# Altium project rfsoc-fr1-beamformer.PrjPcb (part 2 of 2)

## Sheet Buck_TPSM82913_5V5.SchDoc
size B; SheetNumber: 7; SheetTotal: 12
Used 3 times, as channels U_Power/Buck_TPSM82913_5V5_A, U_Power/Buck_TPSM82913_5V5_B, U_Power/Buck_TPSM82913_5V5_C. Parts and nets are listed once, with the designators drawn on the sheet.
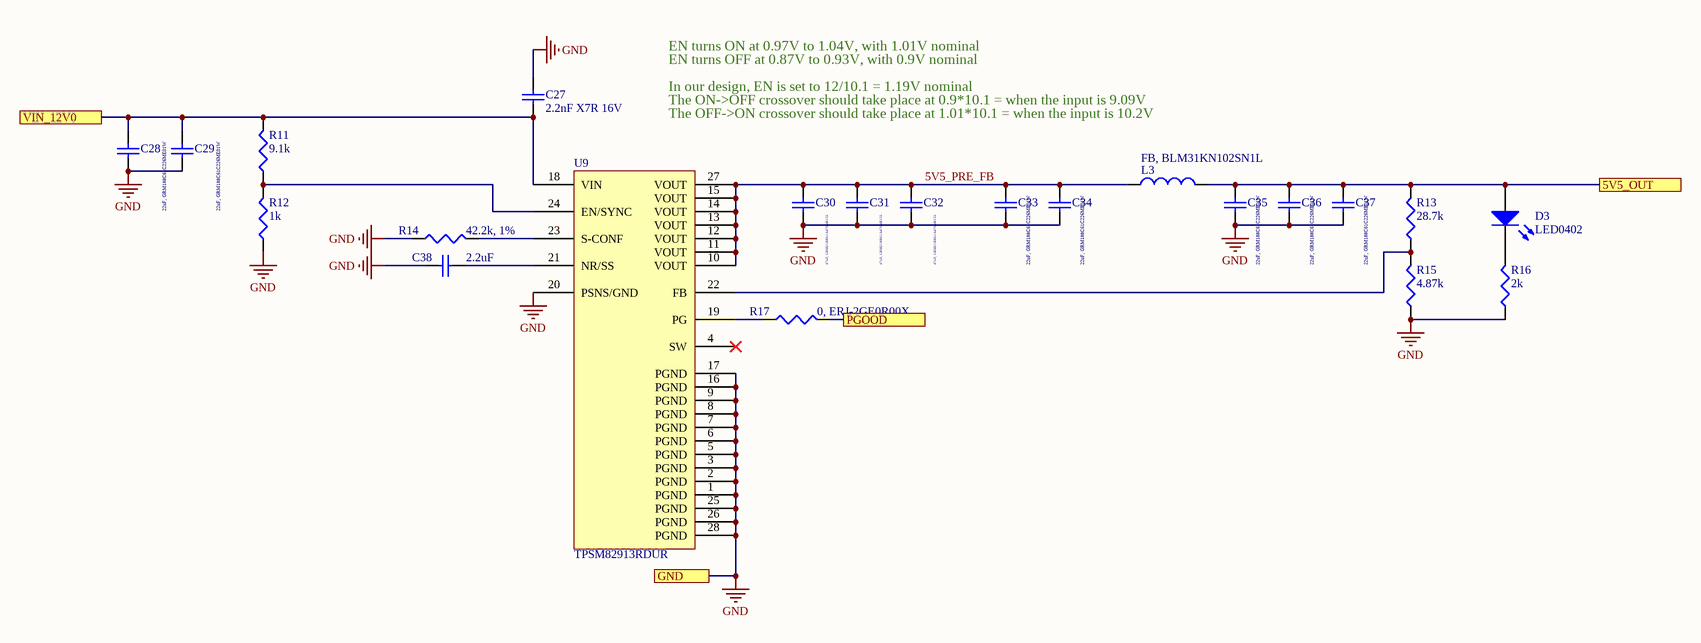
[diagram p9: Buck_TPSM82913_5V5.SchDoc]

### Parts
C27  2.2nF X7R 16V  [SMD-0402]
C28  22uF, GRM188C61C226ME01W  [SMD-0603]
C29  22uF, GRM188C61C226ME01W  [SMD-0603]
C30  47uF, GRM21BR61A476ME15L  [SMD-0805]
C31  47uF, GRM21BR61A476ME15L  [SMD-0805]
C32  47uF, GRM21BR61A476ME15L  [SMD-0805]
C33  22uF, GRM188C61C226ME01W  [SMD-0603]
C34  22uF, GRM188C61C226ME01W  [SMD-0603]
C35  22uF, GRM188C61C226ME01W  [SMD-0603]
C36  22uF, GRM188C61C226ME01W  [SMD-0603]
C37  22uF, GRM188C61C226ME01W  [SMD-0603]
C38  2.2uF  [SMD-0402]
D3  LED0402  [LED-0402]
L3  FB, BLM31KN102SN1L  [SMD-1206]
R11  9.1k  [SMD-0402]
R12  1k  [SMD-0402]
R13  28.7k  [SMD-0402]
R14  42.2k, 1%  [SMD-0402]
R15  4.87k  [SMD-0402]
R16  2k  [SMD-0402]
R17  0, ERJ-2GE0R00X  [SMD-0402]
U9  TPSM82913RDUR  [TPSM82913DRUR]

### Ports
5V5_OUT, GND, PGOOD, VIN_12V0

### Nets
GND: C27.2 C28.1 C29.1 C30.1 C31.1 C32.1 C33.1 C34.1 C35.1 C36.1 C37.1 C38.1 R12.1 R14.1 R15.1 R16.1 U9.1(PGND) U9.2(PGND) U9.3(PGND) U9.5(PGND) U9.6(PGND) U9.7(PGND) U9.8(PGND) U9.9(PGND) U9.16(PGND) U9.17(PGND) U9.20(PSNS/GND) U9.25(PGND) U9.26(PGND) U9.28(PGND) ; port GND
5V5_OUT: C35.2 C36.2 C37.2 D3.2(A) L3.2 R13.2 ; port 5V5_OUT
5V5_PRE_FB: C30.2 C31.2 C32.2 C33.2 C34.2 L3.1 U9.10(VOUT) U9.11(VOUT) U9.12(VOUT) U9.13(VOUT) U9.14(VOUT) U9.15(VOUT) U9.27(VOUT)
PGOOD: R17.2 ; port PGOOD
VIN_12V0: C27.1 C28.2 C29.2 R11.2 U9.18(VIN) ; port VIN_12V0
NetC38_2: C38.2 U9.21(NR/SS)
NetD3_1: D3.1(K) R16.2
NetR11_1: R11.1 R12.2 U9.24(EN/SYNC)
NetR13_1: R13.1 R15.2 U9.22(FB)
NetR14_2: R14.2 U9.23(S-CONF)
NetR17_1: R17.1 U9.19(PG)

Not connected (* = marked no-connect by the designer): U9 4(SW)*

### Channels
U_Power/Buck_TPSM82913_5V5_A: designators end in _1; ports 5V5_OUT=5V5_A GND=GND PGOOD=NetR17_1_2 VIN_12V0=+12
U_Power/Buck_TPSM82913_5V5_B: designators end in _2; ports 5V5_OUT=5V5_B GND=GND PGOOD=NetR17_2_2 VIN_12V0=+12
U_Power/Buck_TPSM82913_5V5_C: designators end in _3; ports 5V5_OUT=5V5_C GND=GND PGOOD=NetR17_3_2 VIN_12V0=+12

### Notes on the sheet
- EN turns OFF at 0.87V to 0.93V, with 0.9V nominal
- EN turns ON at 0.97V to 1.04V, with 1.01V nominal
- In our design, EN is set to 12/10.1 = 1.19V nominal
- The ON->OFF crossover should take place at 0.9*10.1 = when the input is 9.09V
- The OFF->ON crossover should take place at 1.01*10.1 = when the input is 10.2V

### Library data of the parts
C27 C38 = CAP0402: Ceramic Capacitor 0402
C28 C29 C33-C37 = CAP0603: Ceramic Capacitor 0603
C30-C32 = CAP0805: Ceramic Capacitor 0805 Imperial (2012 Metric)
D3 = LED0402: LED 0402
L3 = L1206: Inductor 1206
R11-R17 = RES0402: Resistor-0402
U9 = TPSM82913RDU

## Sheet Buck_TPSM843321_9V0.SchDoc
size A; SheetNumber: 8; SheetTotal: 17
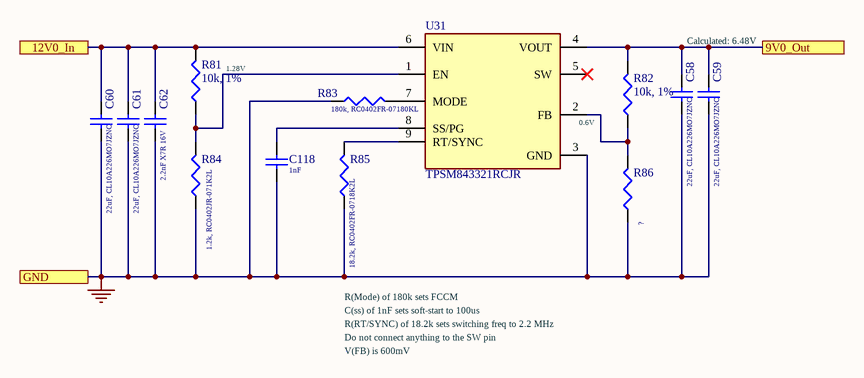
[diagram p10: Buck_TPSM843321_9V0.SchDoc]

### Parts
C58  22uF, CL10A226MO7JZNC  [SMD-0603]
C59  22uF, CL10A226MO7JZNC  [SMD-0603]
C60  22uF, CL10A226MO7JZNC  [SMD-0603]
C61  22uF, CL10A226MO7JZNC  [SMD-0603]
C62  2.2nF X7R 16V  [SMD-0402]
C118  1nF  [SMD-0402]
R81  10k, 1%  [SMD-0402]
R82  10k, 1%  [SMD-0402]
R83  180k, RC0402FR-07180KL  [SMD-0402]
R84  1.2k, RC0402JR-071K2L  [SMD-0402]
R85  18.2k, RC0402FR-0718K2L  [SMD-0402]
R86  ?  [SMD-0402]
U31  TPSM843321RCJR  [TPSM843321RCJR]

### Ports
9V0_Out, 12V0_In, GND

### Nets
9V0: C58.2 C59.2 R82.2 U31.4(VOUT) ; port 9V0_Out
+12: C60.2 C61.2 C62.2 R81.2 U31.6(VIN) ; port 12V0_In
GND: C58.1 C59.1 C60.1 C61.1 C62.1 C118.2 R83.1 R84.1 R85.1 R86.1 U31.3(GND) ; port GND
NetC118_1: C118.1 U31.8(SS/PG)
NetR81_1: R81.1 R84.2 U31.1(EN)
NetR82_1: R82.1 R86.2 U31.2(FB)
NetR83_2: R83.2 U31.7(MODE)
NetR85_2: R85.2 U31.9(RT/SYNC)

Not connected (* = marked no-connect by the designer): U31 5(SW)*

### Notes on the sheet
- Calculated: 6.48V
- (near R81) 1.28V
- (near U31) 0.6V
- R(RT/SYNC) of 18.2k sets switching freq to 2.2 MHz
- R(Mode) of 180k sets FCCM
- C(ss) of 1nF sets soft-start to 100us
- Do not connect anything to the SW pin
- V(FB) is 600mV

### Library data of the parts
C58-C61 = CAP0603: Ceramic Capacitor 0603
C62 C118 = CAP0402: Ceramic Capacitor 0402
R81-R86 = RES0402: Resistor-0402
U31 = TPSM843321RCJR: Non-Isolated PoL Module DC DC Converter 1 Output 5V 3A 3.8V - 18V Input; MF: Texas Instruments; SnapEDA_Link: https://www.snapeda.com/parts/TPSM843321RCJR/Texas+Instruments/view-part/?ref=snap; Package: None; Value: *; MP: TPSM843321RCJR; Check_prices: https://www.snapeda.com/parts/TPSM843321RCJR/Texas+Instruments/view-part/?ref=eda

## Sheet TX_PA_Stage2.SchDoc
size B; SheetNumber: 8; SheetTotal: 12
Used 8 times, as channels PA_A_00, PA_A_01, PA_A_02, PA_A_03, PA_A_04, PA_A_05, PA_A_06, PA_A_07. Parts and nets are listed once, with the designators drawn on the sheet.
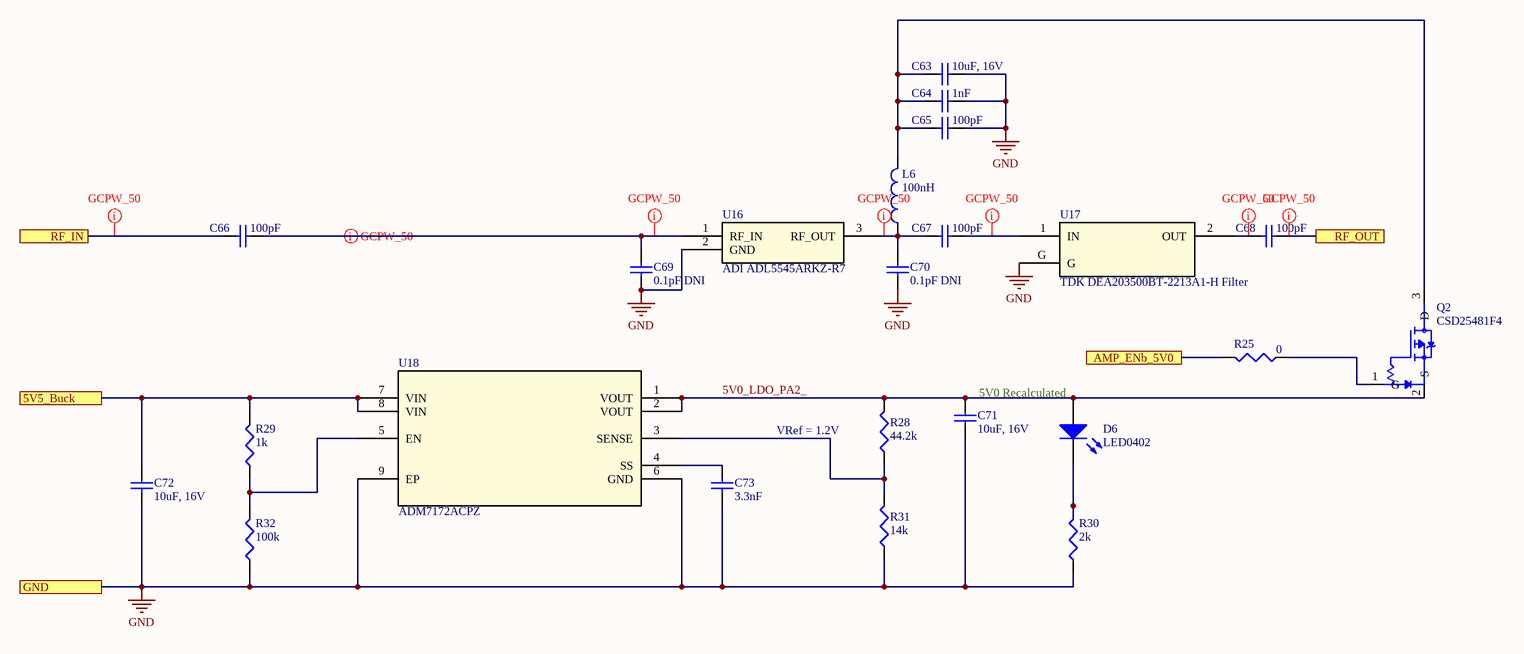
[diagram p11: TX_PA_Stage2.SchDoc]

### Parts
C63  10uF, 16V  [SMD-0603]
C64  1nF  [SMD-0402]
C65  100pF  [SMD-0402]
C66  100pF  [SMD-0402]
C67  100pF  [SMD-0402]
C68  100pF  [SMD-0402]
C69  0.1pF DNI  [SMD-0402]
C70  0.1pF DNI  [SMD-0402]
C71  10uF, 16V  [SMD-0603]
C72  10uF, 16V  [SMD-0603]
C73  3.3nF  [Johanson-0201]
D6  LED0402  [LED-0402]
L6  100nH  [SMD-0402]
Q2  CSD25481F4  [CSD25481F4]
R25  0  [SMD-0402]
R28  44.2k  [SMD-0402]
R29  1k  [SMD-0402]
R30  2k  [SMD-0402]
R31  14k  [SMD-0402]
R32  100k  [SMD-0402]
U16  ADI ADL5545ARKZ-R7  [Analog Devices ADL5545ARKZ]
U17  TDK DEA203500BT-2213A1-H Filter  [TDK DEA203500BT-2213A1-H Bandpass Filter]
U18  ADM7172ACPZ  [ADM7172_VIA_NOSILK]

### Ports
5V5_Buck, AMP_ENb_5V0, GND, RF_IN, RF_OUT

### Nets
GND: C63.1 C64.2 C65.2 C69.1 C70.1 C71.1 C72.1 C73.1 R30.1 R31.1 R32.1 U16.2(GND) U17.G U18.6(GND) U18.9(EP) ; port GND
5V0_LDO_PA2_: C71.2 D6.2(A) Q2.2(S) R28.2 U18.1(VOUT) U18.2(VOUT)
5V5_Buck: C72.2 R29.2 U18.7(VIN) U18.8(VIN) ; port 5V5_Buck
AMP_ENb_5V0: R25.2 ; port AMP_ENb_5V0
RF_IN: C66.1 ; port RF_IN
RF_OUT: C68.2 ; port RF_OUT
NetC63_2: C63.2 C64.1 C65.1 L6.2 Q2.3(D)
NetC66_2: C66.2 C69.2 U16.1(RF_IN)
NetC67_1: C67.1 C70.2 L6.1 U16.3(RF_OUT)
NetC67_2: C67.2 U17.1(IN)
NetC68_1: C68.1 U17.2(OUT)
NetC73_2: C73.2 U18.4(SS)
NetD6_1: D6.1(K) R30.2
NetQ2_1: Q2.1(G) R25.1
NetR28_1: R28.1 R31.2 U18.3(SENSE)
NetR29_1: R29.1 R32.2 U18.5(EN)

### Channels
PA_A_00: designators end in _1; ports 5V5_Buck=5V5_A AMP_ENb_5V0=TX_REF_ENb GND=GND RF_IN=NetC5_1_2 RF_OUT=NetC68_1_2
PA_A_01: designators end in _2; ports 5V5_Buck=5V5_A AMP_ENb_5V0=TX_MAIN_ENb GND=GND RF_IN=NetC5_2_2 RF_OUT=NetC21_16_2
PA_A_02: designators end in _3; ports 5V5_Buck=5V5_A AMP_ENb_5V0=TX_MAIN_ENb GND=GND RF_IN=NetC5_3_2 RF_OUT=NetC21_17_2
PA_A_03: designators end in _4; ports 5V5_Buck=5V5_A AMP_ENb_5V0=TX_MAIN_ENb GND=GND RF_IN=NetC5_4_2 RF_OUT=NetC21_18_2
PA_A_04: designators end in _5; ports 5V5_Buck=5V5_A AMP_ENb_5V0=TX_MAIN_ENb GND=GND RF_IN=NetC5_5_2 RF_OUT=NetC21_19_2
PA_A_05: designators end in _6; ports 5V5_Buck=5V5_A AMP_ENb_5V0=TX_MAIN_ENb GND=GND RF_IN=NetC5_6_2 RF_OUT=NetC21_20_2
PA_A_06: designators end in _7; ports 5V5_Buck=5V5_A AMP_ENb_5V0=TX_MAIN_ENb GND=GND RF_IN=NetC5_7_2 RF_OUT=NetC21_21_2
PA_A_07: designators end in _8; ports 5V5_Buck=5V5_A AMP_ENb_5V0=TX_MAIN_ENb GND=GND RF_IN=NetC5_8_2 RF_OUT=NetC21_22_2

### Layout directives
net class GCPW_50: NetC5_1_2, NetC66_1_2, NetC67_1_1, NetC67_1_2, NetC68_1_1, NetC68_1_2

### Notes on the sheet
- 5V0 Recalculated
- (near R28) VRef = 1.2V

### Library data of the parts
C63 C71 C72 = CAP0603: Ceramic Capacitor 0603
C64-C70 = CAP0402: Ceramic Capacitor 0402
C73 = CAP0201: Capacitor 0201 Imperial
D6 = LED0402: LED 0402
L6 = L0402: Inductor 0402
Q2 = CSD25481F4: -20V, P ch NexFET MOSFET, single LGA 0.6x1.0, 105mOhm 3-PICOSTAR -55 to 150; MF: Texas Instruments; MP: CSD25481F4; Purchase-URL: https://pricing.snapeda.com/search/part/CSD25481F4/?ref=eda; Price: None; SnapEDA_Link: https://www.snapeda.com/parts/CSD25481F4/Texas%20Instruments/view-part/808987/?ref=snap; Check_prices: https://www.snapeda.com/parts/CSD25481F4/Texas%20Instruments/view-part/808987/?ref=eda; Package: PICOSTAR-3 Texas Instruments; Availability: Good; Value: *
R25 R28-R32 = RES0402: Resistor-0402
U16 = ADI ADL5545ARKZ-R7: No Description Available; Mfr_Name: Analog Devices Inc; RefDes: RefDes; Type: Type
U17 = TDK DEA203500BT-2213A1-H Filter: 3.5 GHz Center Freq BPF; Mfr_Name: TDK; RefDes: RefDes; Type: Type
U18 = ADM7172ACPZ: 6.5V, 2A, Ultralow Noise, High PSRR, Fast Transient Response CMOS LDO; Value: Value; Type: Type; RefDes: RefDes

## Sheet Switch_SPDT.SchDoc
size A; SheetNumber: 10; SheetTotal: 17
Used 2 times, as channels U_Switch_SPDT, U_Switch_SPDT. Parts and nets are listed once, with the designators drawn on the sheet.
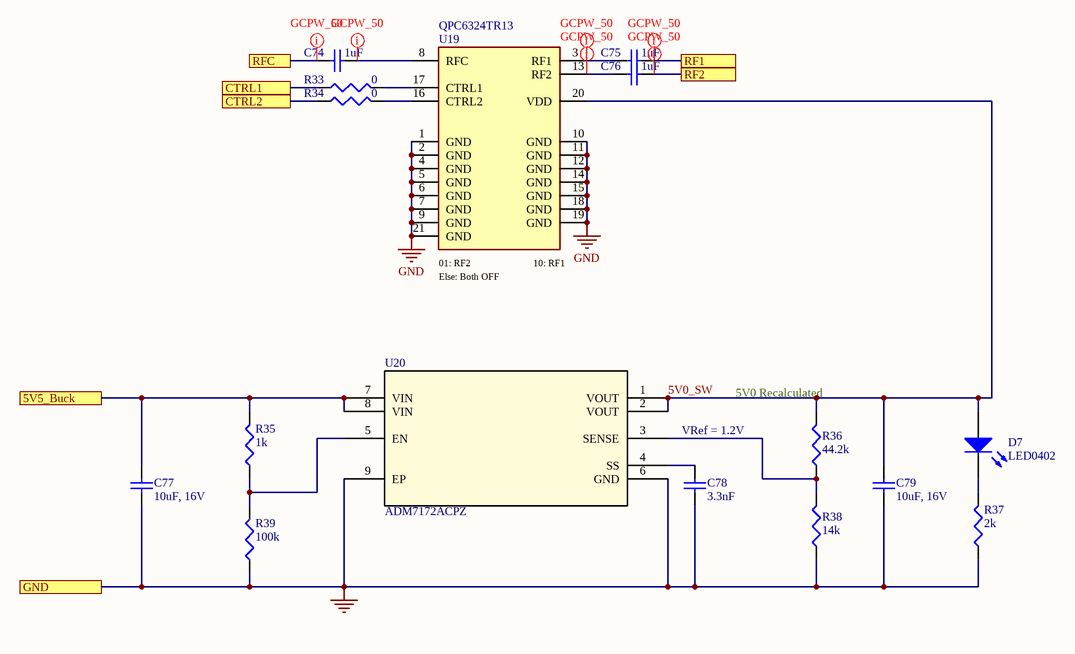
[diagram p12: Switch_SPDT.SchDoc]

### Parts
C74  1uF  [SMD-0402]
C75  1uF  [SMD-0402]
C76  1uF  [SMD-0402]
C77  10uF, 16V  [SMD-0603]
C78  3.3nF  [Johanson-0201]
C79  10uF, 16V  [SMD-0603]
D7  LED0402  [LED-0402]
R33  0  [SMD-0402]
R34  0  [SMD-0402]
R35  1k  [SMD-0402]
R36  44.2k  [SMD-0402]
R37  2k  [SMD-0402]
R38  14k  [SMD-0402]
R39  100k  [SMD-0402]
U19  QPC6324TR13  [Qorvo QFN50P400X400X90-21N-D]
U20  ADM7172ACPZ  [ADM7172_VIA_NOSILK]

### Ports
5V5_Buck, CTRL1, CTRL2, GND, RF1, RF2, RFC

### Nets
GND: C77.1 C78.1 C79.1 R37.1 R38.1 R39.1 U19.1(GND) U19.2(GND) U19.4(GND) U19.5(GND) U19.6(GND) U19.7(GND) U19.9(GND) U19.10(GND) U19.11(GND) U19.12(GND) U19.14(GND) U19.15(GND) U19.18(GND) U19.19(GND) U19.21(GND) U20.6(GND) U20.9(EP) ; port GND
5V0_SW: C79.2 D7.2(A) R36.2 U19.20(VDD) U20.1(VOUT) U20.2(VOUT)
5V5_Buck: C77.2 R35.2 U20.7(VIN) U20.8(VIN) ; port 5V5_Buck
CTRL1: R33.1 ; port CTRL1
CTRL2: R34.1 ; port CTRL2
RF1: C75.2 ; port RF1
RF2: C76.2 ; port RF2
RFC: C74.1 ; port RFC
NetC74_2: C74.2 U19.8(RFC)
NetC75_1: C75.1 U19.3(RF1)
NetC76_1: C76.1 U19.13(RF2)
NetC78_2: C78.2 U20.4(SS)
NetD7_1: D7.1(K) R37.2
NetR33_2: R33.2 U19.17(CTRL1)
NetR34_2: R34.2 U19.16(CTRL2)
NetR35_1: R35.1 R39.2 U20.5(EN)
NetR36_1: R36.1 R38.2 U20.3(SENSE)

### Channels
U_Switch_SPDT: designators end in _1; ports 5V5_Buck=5V5_A CTRL1=CTRL1 CTRL2=CTRL2 GND=GND RF1=NetC75_1_2 RF2=NetC76_1_2 RFC=NetC68_1_2
U_Switch_SPDT: designators end in _2; ports 5V5_Buck=5V5_C CTRL1=CTRL1 CTRL2=CTRL2 GND=GND RF1=NetC75_2_2 RF2=NetC76_2_2 RFC=NetC21_8_2

### Layout directives
net class GCPW_50: NetC68_1_2, NetC74_1_2, NetC75_1_1, NetC75_1_2, NetC76_1_1, NetC76_1_2

### Notes on the sheet
- (near R36) 5V0 Recalculated
- VRef = 1.2V
- (in symbol Qorvo QPC6324TR13) 01: RF2; 10: RF1; Else: Both OFF

### Library data of the parts
C74-C76 = CAP0402: Ceramic Capacitor 0402
C77 C79 = CAP0603: Ceramic Capacitor 0603
C78 = CAP0201: Capacitor 0201 Imperial
D7 = LED0402: LED 0402
R33-R39 = RES0402: Resistor-0402
U19 = Qorvo QPC6324TR13: 5 MHz to 6000 MHz Operation  Non-Reflective (RFX ports)  Terminated All-Off State mode  No Blocking Caps needed unless voltage is on RF Line  High Isolation: RFC-RFX: 63 dB at 2 GHz  RFX-RFX: 63 dB at 2 GHz  +1.8 V Logic Compatible; Manufacturer_Name: Qorvo; Geometry.Height: 0.9mm; Manufacturer_Part_Number: QPC6324TR13; Mouser Part Number: 772-QPC6324TR13; Mouser Price/Stock: https://www.mouser.co.uk/ProductDetail/Qorvo/QPC6324TR13?qs=W0yvOO0ixfHza5Li%252BN2uIg%3D%3D; Arrow Part Number: *; Arrow Price/Stock: *; Datasheet Link: https://www.qorvo.com/products/d/da006332
U20 = ADM7172ACPZ: as U18 on sheet TX_PA_Stage2; Value: Value; Type: Type; RefDes: RefDes

## Sheet Status_LEDs.SchDoc
size B; SheetNumber: 10; SheetTotal: 12
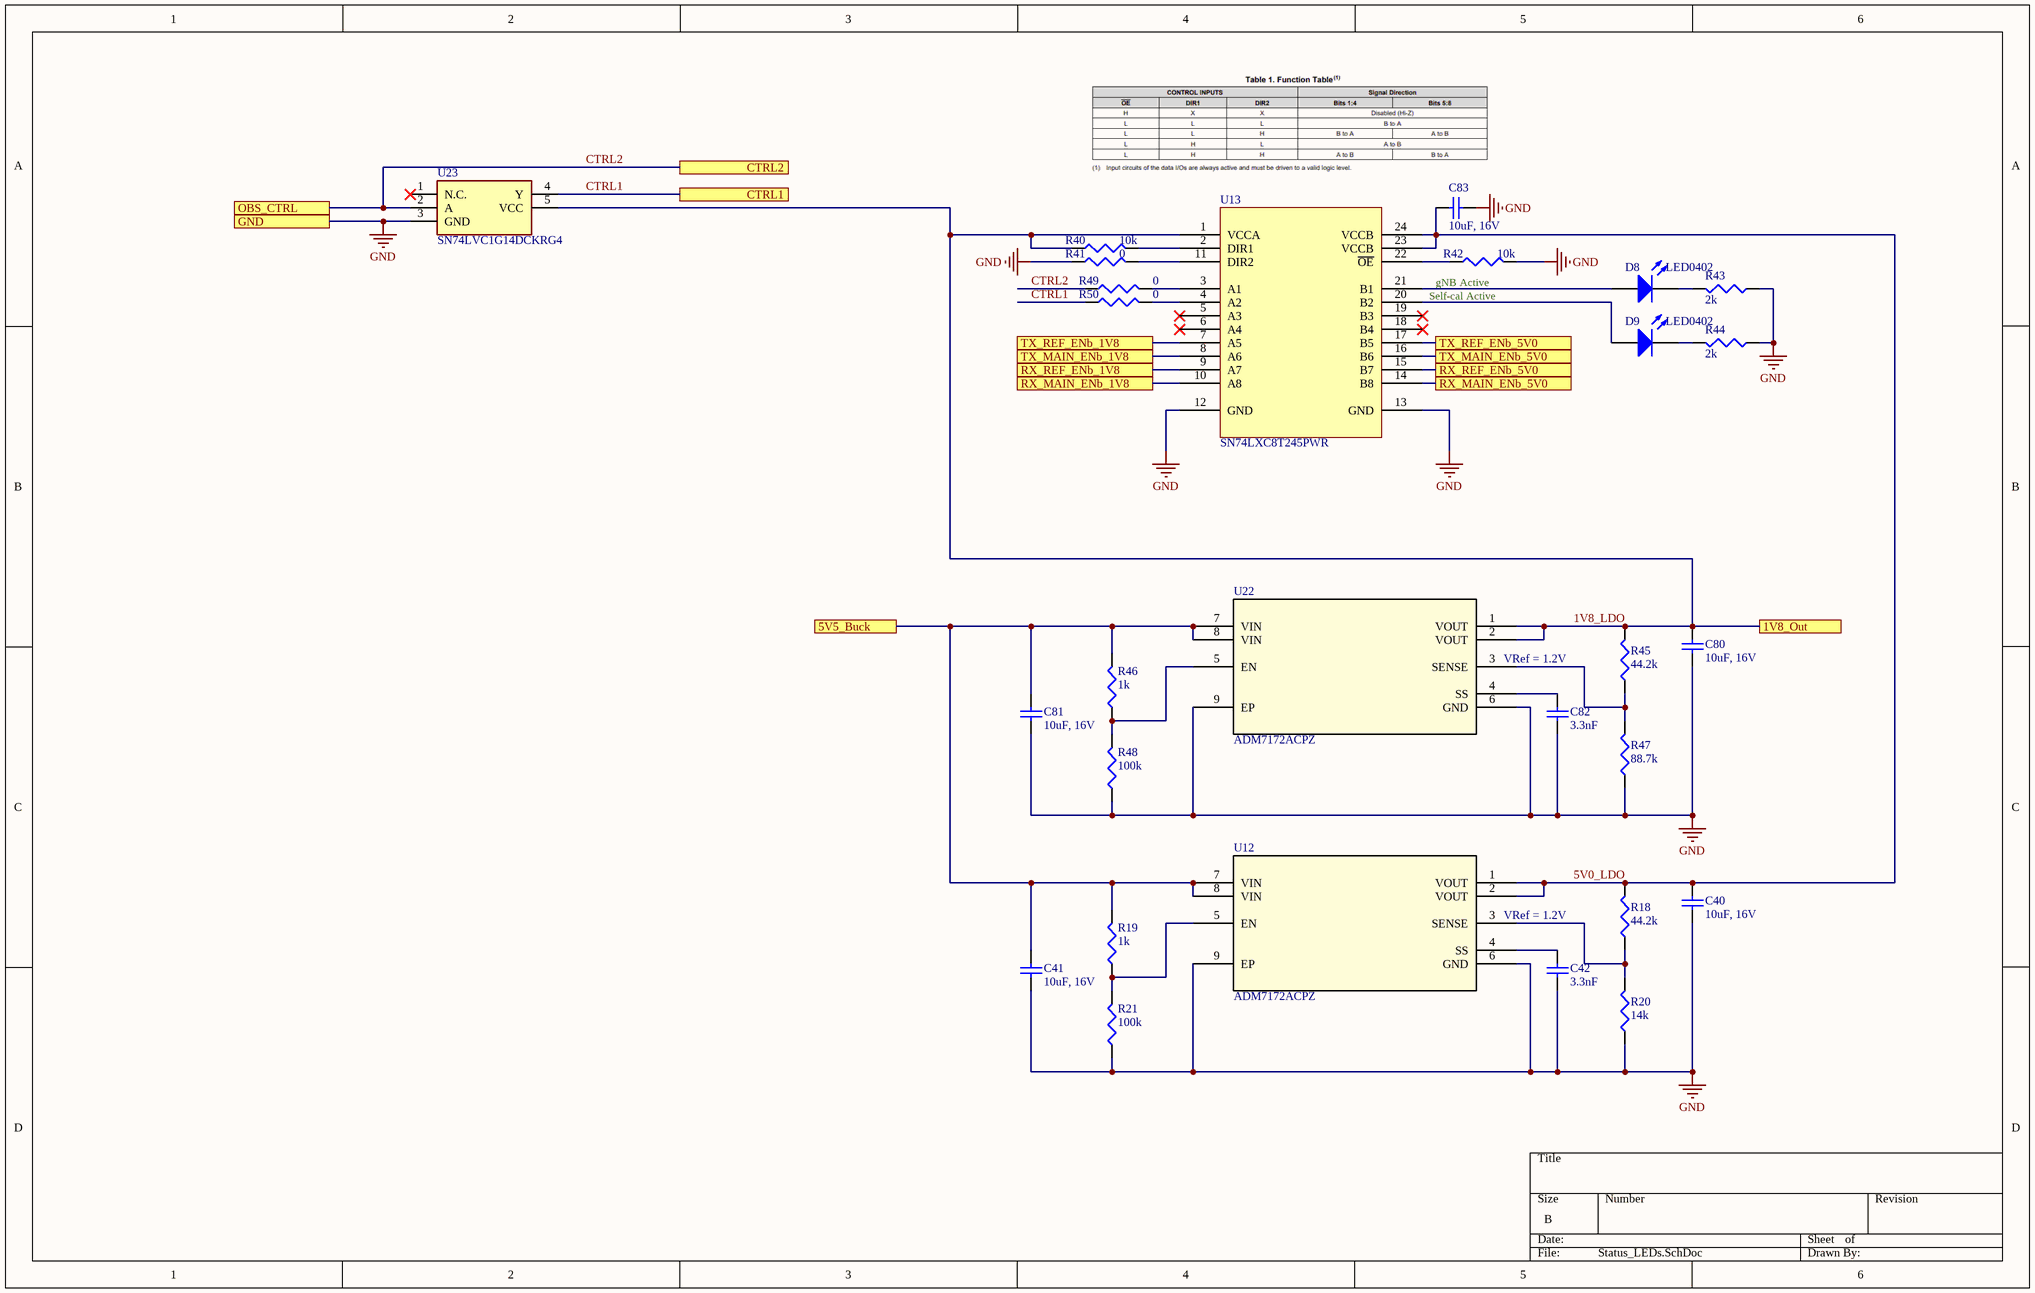
[diagram p13: Status_LEDs.SchDoc]

### Parts
C40  10uF, 16V  [SMD-0603]
C41  10uF, 16V  [SMD-0603]
C42  3.3nF  [Johanson-0201]
C80  10uF, 16V  [SMD-0603]
C81  10uF, 16V  [SMD-0603]
C82  3.3nF  [Johanson-0201]
C83  10uF, 16V  [SMD-0603]
D8  LED0402  [LED-0402]
D9  LED0402  [LED-0402]
R18  44.2k  [SMD-0402]
R19  1k  [SMD-0402]
R20  14k  [SMD-0402]
R21  100k  [SMD-0402]
R40  10k  [SMD-0402]
R41  0  [SMD-0402]
R42  10k  [SMD-0402]
R43  2k  [SMD-0402]
R44  2k  [SMD-0402]
R45  44.2k  [SMD-0402]
R46  1k  [SMD-0402]
R47  88.7k  [SMD-0402]
R48  100k  [SMD-0402]
R49  0  [SMD-0402]
R50  0  [SMD-0402]
U12  ADM7172ACPZ  [ADM7172_VIA_NOSILK]
U13  SN74LXC8T245PWR  [SN74AXC8T245PWR]
U22  ADM7172ACPZ  [ADM7172_VIA_NOSILK]
U23  SN74LVC1G14DCKRG4  [SN74LVC1G14DCKRG4]

### Ports
1V8_Out, 5V5_Buck, CTRL1, CTRL2, GND, OBS_CTRL, RX_MAIN_ENb_1V8, RX_MAIN_ENb_5V0, RX_REF_ENb_1V8, RX_REF_ENb_5V0, TX_MAIN_ENb_1V8, TX_MAIN_ENb_5V0, TX_REF_ENb_1V8, TX_REF_ENb_5V0

### Nets
5V5_B: C41.2 C81.2 R19.2 R46.2 U12.7(VIN) U12.8(VIN) U22.7(VIN) U22.8(VIN) ; port 5V5_Buck
GND: C40.1 C41.1 C42.1 C80.1 C81.1 C82.1 C83.1 R20.1 R21.1 R41.1 R42.2 R43.1 R44.1 R47.1 R48.1 U12.6(GND) U12.9(EP) U13.12(GND) U13.13(GND) U22.6(GND) U22.9(EP) U23.3(GND) ; port GND
1V8_LDO: C80.2 R40.1 R45.2 U13.1(VCCA) U22.1(VOUT) U22.2(VOUT) U23.5(VCC) ; port 1V8_Out
5V0_LDO: C40.2 C83.2 R18.2 U12.1(VOUT) U12.2(VOUT) U13.23(VCCB) U13.24(VCCB)
CTRL1: R50.1 U23.4(Y) ; port CTRL1
CTRL2: R49.1 U23.2(A) ; port OBS_CTRL, port CTRL2
RX_MAIN_ENb: U13.14(B8) ; port RX_MAIN_ENb_5V0
RX_MAIN_ENb_1V8: U13.10(A8) ; port RX_MAIN_ENb_1V8
RX_REF_ENb: U13.15(B7) ; port RX_REF_ENb_5V0
RX_REF_ENb_1V8: U13.9(A7) ; port RX_REF_ENb_1V8
TX_MAIN_ENb: U13.16(B6) ; port TX_MAIN_ENb_5V0
TX_MAIN_ENb_1V8: U13.8(A6) ; port TX_MAIN_ENb_1V8
TX_REF_ENb: U13.17(B5) ; port TX_REF_ENb_5V0
TX_REF_ENb_1V8: U13.7(A5) ; port TX_REF_ENb_1V8
NetC42_2: C42.2 U12.4(SS)
NetC82_2: C82.2 U22.4(SS)
NetD8_1: D8.1(K) R43.2
NetD8_2: D8.2(A) U13.21(B1)
NetD9_1: D9.1(K) R44.2
NetD9_2: D9.2(A) U13.20(B2)
NetR18_1: R18.1 R20.2 U12.3(SENSE)
NetR19_1: R19.1 R21.2 U12.5(EN)
NetR40_2: R40.2 U13.2(DIR1)
NetR41_2: R41.2 U13.11(DIR2)
NetR42_1: R42.1 U13.22(~{OE})
NetR45_1: R45.1 R47.2 U22.3(SENSE)
NetR46_1: R46.1 R48.2 U22.5(EN)
NetR49_2: R49.2 U13.3(A1)
NetR50_2: R50.2 U13.4(A2)

Not connected (* = marked no-connect by the designer): U13 5(A3)* 6(A4)* 18(B4)* 19(B3)*; U23 1(N.C.)*

### Notes on the sheet
- (near R42) gNB Active
- Self-cal Active
- VRef = 1.2V

### Library data of the parts
C40 C41 C80 C81 C83 = CAP0603: Ceramic Capacitor 0603
C42 C82 = CAP0201: Capacitor 0201 Imperial
D8 D9 = LED0402: LED 0402
R18-R21 R40-R50 = RES0402: Resistor-0402
U12 U22 = ADM7172ACPZ: as U18 on sheet TX_PA_Stage2; Value: Value; Type: Type; RefDes: RefDes
U13 = SN74AXC8T245PWR: SN74LXC8T245 8-Bit Dual-Supply Bus Transceiver With Configurable Voltage Translation / and Tri-State Outputs
U23 = SN74LVC1G14DCKRG4: Single Schmitt-Trigger Inverter; Manufacturer_Name: Texas Instruments; Geometry.Height: 1.1mm; Manufacturer_Part_Number: SN74LVC1G14DCKRG4; Mouser Part Number: 595-SN74LVC1G14DCKG4; Mouser Price/Stock: https://www.mouser.co.uk/ProductDetail/Texas-Instruments/SN74LVC1G14DCKRG4?qs=pajgIaoyDUh5K3ZGC7gUbg%3D%3D; Arrow Part Number: SN74LVC1G14DCKRG4; Arrow Price/Stock: https://www.arrow.com/en/products/sn74lvc1g14dckrg4/texas-instruments?utm_currency=USD&region=nac; Datasheet Link: http://www.ti.com/lit/gpn/SN74LVC1G14

## Sheet Trigger_Input.SchDoc
size A; SheetNumber: 11; SheetTotal: 12
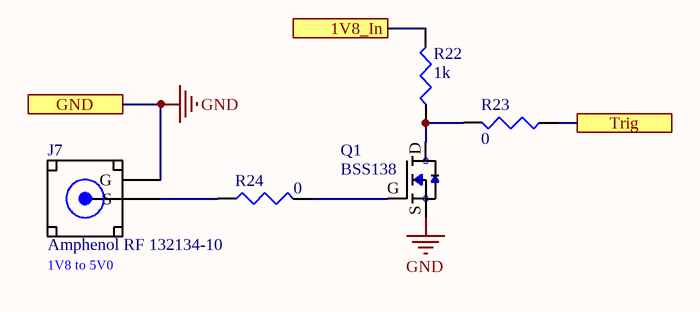
[diagram p14: Trigger_Input.SchDoc]

### Parts
J7  Amphenol RF 132134-10  [Amphenol RF 132134-10 HFSS 8.8 mil]
Q1  BSS138  [BSS138-SOT23]
R22  1k  [SMD-0603]
R23  0  [SMD-0603]
R24  0  [SMD-0603]

### Ports
1V8_In, GND, Trig

### Nets
GND: J7.G Q1.S ; port GND
1V8_LDO: R22.2 ; port 1V8_In
TRIG_IN_1V8: R23.1 ; port Trig
NetJ7_S: J7.S R24.1
NetQ1_D: Q1.D R22.1 R23.2
NetQ1_G: Q1.G R24.2

### Notes on the sheet
- (near J7) 1V8 to 5V0

### Library data of the parts
J7 = Amphenol RF 132134-10: RF / Coaxial Connector, SMA Coaxial, Straight Jack, Surface Mount Vertical, 50 ohm; MF: Samtec; MP: SMA-J-P-H-ST-EM1; Price: None; SnapEDA_Link: https://www.snapeda.com/parts/SMA-J-P-H-ST-EM1/Samtec%20Inc./view-part/?ref=snap; Package: None; Availability: Unavailable; Value: *
Q1 = BSS138: N-Channel Logic Level Enhancement Mode Field Effect Transistor; MF: MICROSS/On Semiconductor; MP: BSS138; Price: None; Availability: Unavailable; Package: TO-236-3 Micross; SnapEDA_Link: https://www.snapeda.com/parts/BSS138/MICROSS/On%20Semiconductor/view-part/?ref=snap; Value: *
R22-R24 = RES0603: Resistor-0603

## Sheet SE_Diff.SchDoc
size A; SheetNumber: 13; SheetTotal: 14
Used 8 times, as channels SE_Diff_RX_00, SE_Diff_RX_01, SE_Diff_RX_02, SE_Diff_RX_03, SE_Diff_RX_04, SE_Diff_RX_05, SE_Diff_RX_06, SE_Diff_RX_07. Parts and nets are listed once, with the designators drawn on the sheet.
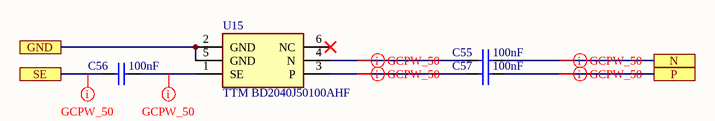
[diagram p15: SE_Diff.SchDoc]

### Parts
C55  100nF  [SMD-0402]
C56  100nF  [SMD-0402]
C57  100nF  [SMD-0402]
U15  TTM BD2040J50100AHF  [Anaren Balun BD2040J50100AHF]

### Ports
GND, N, P, SE

### Nets
GND: U15.2(GND) U15.5(GND) ; port GND
N: C55.1 ; port N
P: C57.1 ; port P
SE: C56.2 ; port SE
NetC55_2: C55.2 U15.4(N)
NetC56_1: C56.1 U15.1(SE)
NetC57_2: C57.2 U15.3(P)

Not connected (* = marked no-connect by the designer): U15 6(NC)*

### Channels
SE_Diff_RX_00: designators end in _1; ports GND=GND N=ADC_00_P P=ADC_00_N SE=NetC23_8_1
SE_Diff_RX_01: designators end in _2; ports GND=GND N=ADC_01_P P=ADC_01_N SE=NetC44_8_1
SE_Diff_RX_02: designators end in _3; ports GND=GND N=ADC_02_P P=ADC_02_N SE=NetC44_9_1
SE_Diff_RX_03: designators end in _4; ports GND=GND N=ADC_03_P P=ADC_03_N SE=NetC44_10_1
SE_Diff_RX_04: designators end in _5; ports GND=GND N=ADC_04_P P=ADC_04_N SE=NetC44_11_1
SE_Diff_RX_05: designators end in _6; ports GND=GND N=ADC_05_P P=ADC_05_N SE=NetC44_12_1
SE_Diff_RX_06: designators end in _7; ports GND=GND N=ADC_06_P P=ADC_06_N SE=NetC44_13_1
SE_Diff_RX_07: designators end in _8; ports GND=GND N=ADC_07_P P=ADC_07_N SE=NetC44_14_1

### Layout directives
net class GCPW_50: ADC_00_N, ADC_00_P, NetC23_8_1, NetC55_1_2, NetC56_1_1, NetC57_1_2

### Library data of the parts
C55-C57 = CAP0402: Ceramic Capacitor 0402
U15 = Anaren Balun - BD2040J50100AHF: Filter; Manufacturer_Name: ANAREN; Datasheet Link: https://cdn.anaren.com/product-documents/Xinger/BalunTransformers/BD2040J50100AHF/BD2040J50100AHF_DataSheet(Rev_C).pdf; Height: 0.78mm; Manufacturer_Part_Number: BD2040J50100AHF; Mouser Part Number: 620-BD2040J50100AH; Mouser Price/Stock: https://www.mouser.co.uk/ProductDetail/Anaren/BD2040J50100AHF?qs=BDRISUKNLIfZZVKLkyHFlw%3D%3D

## Sheet HMC625_VGA.SchDoc
size A; SheetNumber: 13; SheetTotal: 17
Used 14 times, as channels VGA_A_01, VGA_A_02, VGA_A_03, VGA_A_04, VGA_A_05, VGA_A_06, VGA_A_07, VGA_B_01, VGA_B_02, VGA_B_03, VGA_B_04, VGA_B_05, VGA_B_06, VGA_B_07. Parts and nets are listed once, with the designators drawn on the sheet.
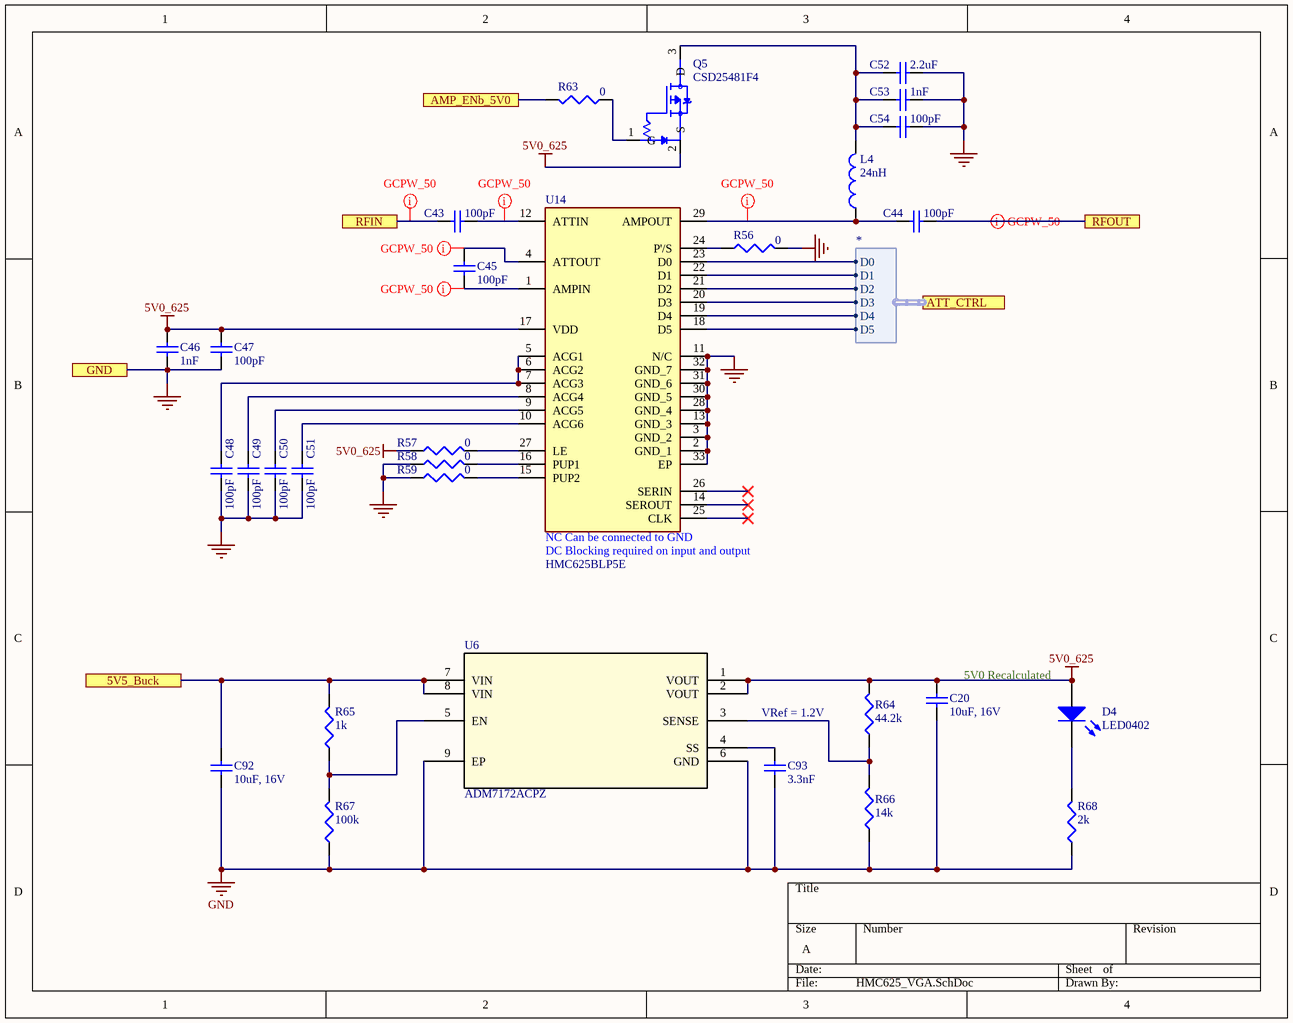
[diagram p16: HMC625_VGA.SchDoc]

### Parts
C20  10uF, 16V  [SMD-0603]
C43  100pF  [SMD-0402]
C44  100pF  [SMD-0402]
C45  100pF  [SMD-0402]
C46  1nF  [SMD-0402]
C47  100pF  [SMD-0402]
C48  100pF  [SMD-0402]
C49  100pF  [SMD-0402]
C50  100pF  [SMD-0402]
C51  100pF  [SMD-0402]
C52  2.2uF  [SMD-0603]
C53  1nF  [SMD-0402]
C54  100pF  [SMD-0402]
C92  10uF, 16V  [SMD-0603]
C93  3.3nF  [Johanson-0201]
D4  LED0402  [LED-0402]
L4  24nH  [L-0402-Coilcraft]
Q5  CSD25481F4  [CSD25481F4]
R56  0  [SMD-0402]
R57  0  [SMD-0402]
R58  0  [SMD-0402]
R59  0  [SMD-0402]
R63  0  [SMD-0402]
R64  44.2k  [SMD-0402]
R65  1k  [SMD-0402]
R66  14k  [SMD-0402]
R67  100k  [SMD-0402]
R68  2k  [SMD-0402]
U6  ADM7172ACPZ  [ADM7172_VIA_NOSILK]
U14  HMC625BLP5E  [Analog Devices HMC625BLP5E]

### Ports
5V5_Buck, AMP_ENb_5V0, ATT_CTRL (harness *), GND, RFIN, RFOUT

### Harnesses
*: D0, D1, D2, D3, D4, D5

### Nets
5V0_625: C20.2 C46.1 C47.1 D4.2(A) Q5.2(S) R57.1 R64.2 U6.1(VOUT) U6.2(VOUT) U14.17(VDD)
GND: C20.1 C46.2 C47.2 C48.2 C49.2 C50.2 C51.2 C52.2 C53.1 C54.1 C92.1 C93.1 R56.2 R58.1 R59.1 R66.1 R67.1 R68.1 U6.6(GND) U6.9(EP) U14.2(GND_1) U14.3(GND_2) U14.11(N/C) U14.13(GND_3) U14.28(GND_4) U14.30(GND_5) U14.31(GND_6) U14.32(GND_7) U14.33(EP) ; port GND
5V5_Buck: C92.2 R65.2 U6.7(VIN) U6.8(VIN) ; port 5V5_Buck
AMP_ENb_5V0: R63.2 ; port AMP_ENb_5V0
RFIN: C43.2 ; port RFIN
RFOUT: C44.1 ; port RFOUT
NetC43_1: C43.1 U14.12(ATTIN)
NetC44_2: C44.2 L4.1 U14.29(AMPOUT)
NetC45_1: C45.1 U14.4(ATTOUT)
NetC45_2: C45.2 U14.1(AMPIN)
NetC48_1: C48.1 U14.5(ACG1) U14.6(ACG2) U14.7(ACG3)
NetC49_1: C49.1 U14.8(ACG4)
NetC50_1: C50.1 U14.9(ACG5)
NetC51_1: C51.1 U14.10(ACG6)
NetC52_1: C52.1 C53.2 C54.2 L4.2 Q5.3(D)
NetC93_2: C93.2 U6.4(SS)
NetD4_1: D4.1(K) R68.2
NetQ5_1: Q5.1(G) R63.1
NetR56_1: R56.1 U14.24(P'/S)
NetR57_2: R57.2 U14.27(LE)
NetR58_2: R58.2 U14.16(PUP1)
NetR59_2: R59.2 U14.15(PUP2)
NetR64_1: R64.1 R66.2 U6.3(SENSE)
NetR65_1: R65.1 R67.2 U6.5(EN)
NetU14_18: U14.18(D5) ; port ATT_CTRL.D5
NetU14_19: U14.19(D4) ; port ATT_CTRL.D4
NetU14_20: U14.20(D3) ; port ATT_CTRL.D3
NetU14_21: U14.21(D2) ; port ATT_CTRL.D2
NetU14_22: U14.22(D1) ; port ATT_CTRL.D1
NetU14_23: U14.23(D0) ; port ATT_CTRL.D0

Not connected (* = marked no-connect by the designer): U14 14(SEROUT)* 25(CLK)* 26(SERIN)*

### Channels
VGA_A_01: designators end in _1; ports 5V5_Buck=5V5_B AMP_ENb_5V0=RX_MAIN_ENb GND=GND RFIN=NetC23_1_1 RFOUT=NetC21_9_2
VGA_A_02: designators end in _2; ports 5V5_Buck=5V5_B AMP_ENb_5V0=RX_MAIN_ENb GND=GND RFIN=NetC23_2_1 RFOUT=NetC21_10_2
VGA_A_03: designators end in _3; ports 5V5_Buck=5V5_B AMP_ENb_5V0=RX_MAIN_ENb GND=GND RFIN=NetC23_3_1 RFOUT=NetC21_11_2
VGA_A_04: designators end in _4; ports 5V5_Buck=5V5_B AMP_ENb_5V0=RX_MAIN_ENb GND=GND RFIN=NetC23_4_1 RFOUT=NetC21_12_2
VGA_A_05: designators end in _5; ports 5V5_Buck=5V5_B AMP_ENb_5V0=RX_MAIN_ENb GND=GND RFIN=NetC23_5_1 RFOUT=NetC21_13_2
VGA_A_06: designators end in _6; ports 5V5_Buck=5V5_B AMP_ENb_5V0=RX_MAIN_ENb GND=GND RFIN=NetC23_6_1 RFOUT=NetC21_14_2
VGA_A_07: designators end in _7; ports 5V5_Buck=5V5_B AMP_ENb_5V0=RX_MAIN_ENb GND=GND RFIN=NetC23_7_1 RFOUT=NetC21_15_2
VGA_B_01: designators end in _8; ports 5V5_Buck=5V5_C AMP_ENb_5V0=RX_MAIN_ENb GND=GND RFIN=NetC23_9_1 RFOUT=NetC44_8_1
VGA_B_02: designators end in _9; ports 5V5_Buck=5V5_C AMP_ENb_5V0=RX_MAIN_ENb GND=GND RFIN=NetC23_10_1 RFOUT=NetC44_9_1
VGA_B_03: designators end in _10; ports 5V5_Buck=5V5_C AMP_ENb_5V0=RX_MAIN_ENb GND=GND RFIN=NetC23_11_1 RFOUT=NetC44_10_1
VGA_B_04: designators end in _11; ports 5V5_Buck=5V5_C AMP_ENb_5V0=RX_MAIN_ENb GND=GND RFIN=NetC23_12_1 RFOUT=NetC44_11_1
VGA_B_05: designators end in _12; ports 5V5_Buck=5V5_C AMP_ENb_5V0=RX_MAIN_ENb GND=GND RFIN=NetC23_13_1 RFOUT=NetC44_12_1
VGA_B_06: designators end in _13; ports 5V5_Buck=5V5_C AMP_ENb_5V0=RX_MAIN_ENb GND=GND RFIN=NetC23_14_1 RFOUT=NetC44_13_1
VGA_B_07: designators end in _14; ports 5V5_Buck=5V5_C AMP_ENb_5V0=RX_MAIN_ENb GND=GND RFIN=NetC23_15_1 RFOUT=NetC44_14_1

### Layout directives
net class GCPW_50: NetC21_9_2, NetC23_1_1, NetC43_1_1, NetC44_1_2, NetC45_1_1, NetC45_1_2

### Notes on the sheet
- 5V0 Recalculated
- VRef = 1.2V
- (in symbol HMC625BLP5E) NC Can be connected to GND; DC Blocking required on input and output

### Library data of the parts
C20 C52 C92 = CAP0603: Ceramic Capacitor 0603
C43-C51 C53 C54 = CAP0402: Ceramic Capacitor 0402
C93 = CAP0201: Capacitor 0201 Imperial
D4 = LED0402: LED 0402
L4 = L0402_CoilCraft: Inductor 0402
Q5 = CSD25481F4: as Q2 on sheet TX_PA_Stage2; MP: CSD25481F4; Purchase-URL: https://pricing.snapeda.com/search/part/CSD25481F4/?ref=eda; Price: None; SnapEDA_Link: https://www.snapeda.com/parts/CSD25481F4/Texas%20Instruments/view-part/808987/?ref=snap; Check_prices: https://www.snapeda.com/parts/CSD25481F4/Texas%20Instruments/view-part/808987/?ref=eda; Package: PICOSTAR-3 Texas Instruments; Availability: Good; Value: *
R56-R59 R63-R68 = RES0402: Resistor-0402
U6 = ADM7172ACPZ: as U18 on sheet TX_PA_Stage2; Value: Value; Type: Type; RefDes: RefDes
U14 = HMC625BLP5E: Integrated Circuit; Manufacturer_Name: Analog Devices; Datasheet Link: https://www.analog.com/media/en/technical-documentation/data-sheets/HMC625B.pdf; Height: 1mm; Manufacturer_Part_Number: HMC625BLP5E; Mouser Part Number: 584-HMC625BLP5E; Mouser Price/Stock: https://www.mouser.co.uk/ProductDetail/Analog-Devices/HMC625BLP5E?qs=JeIcUl65ClAr51XD9R3nFw%3D%3D; Arrow Part Number: HMC625BLP5E; Arrow Price/Stock: https://www.arrow.com/en/products/hmc625blp5e/analog-devices

## Sheet PMA3-83MP+.SchDoc
size A; SheetNumber: 14; SheetTotal: 15
Used 7 times, as channels PMA_01, PMA_02, PMA_03, PMA_04, PMA_05, PMA_06, PMA_07. Parts and nets are listed once, with the designators drawn on the sheet.
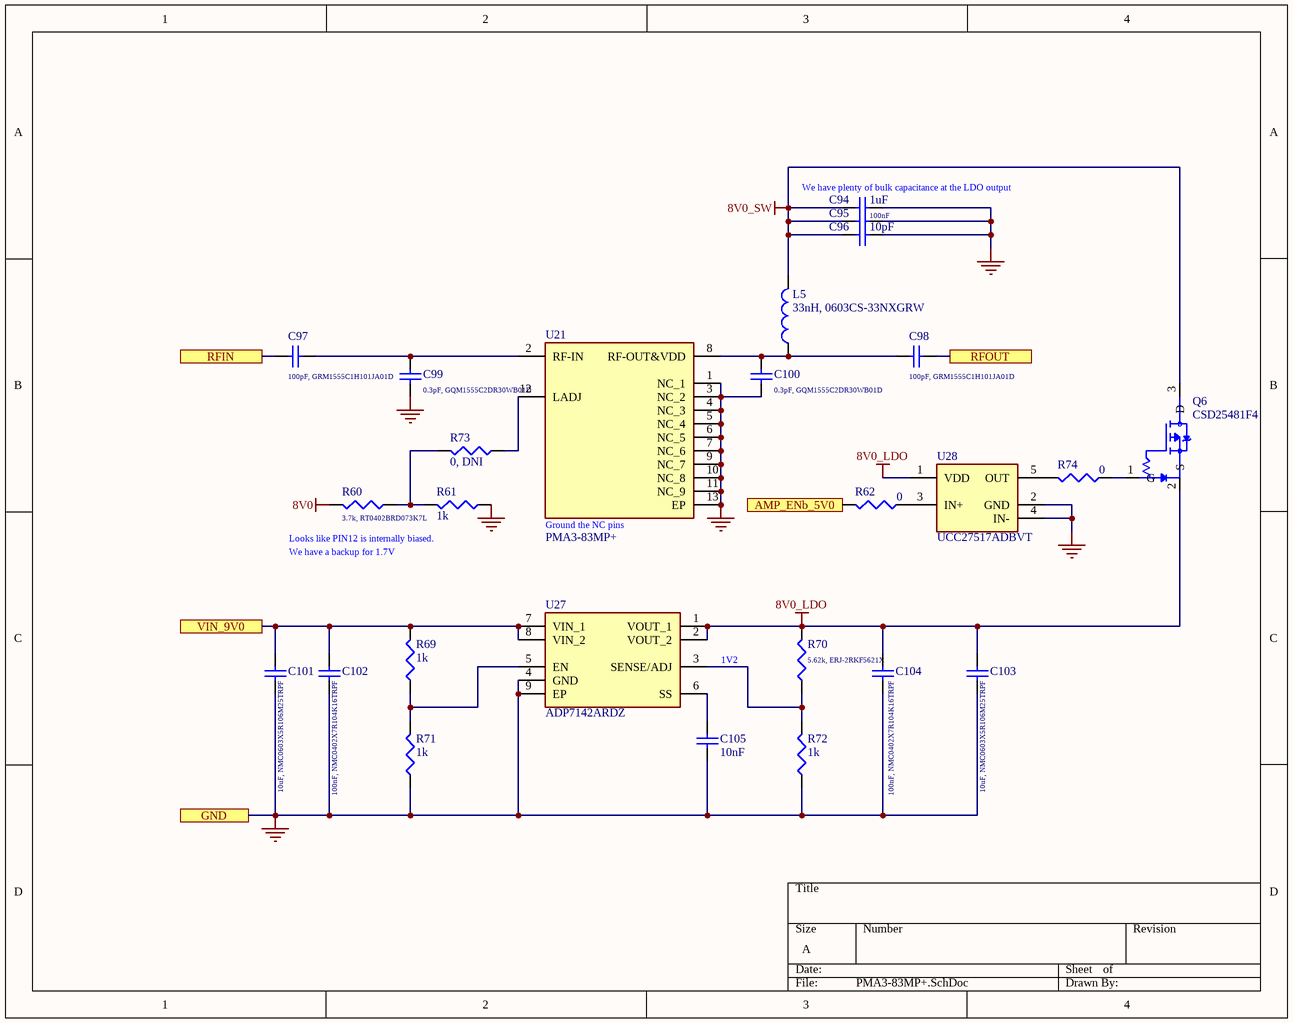
[diagram p17: PMA3-83MP+.SchDoc]

### Parts
C94  1uF  [SMD-0402]
C95  100nF  [SMD-0402]
C96  10pF  [SMD-0402]
C97  100pF, GRM1555C1H101JA01D  [SMD-0402]
C98  100pF, GRM1555C1H101JA01D  [SMD-0402]
C99  0.3pF, GQM1555C2DR30WB01D  [SMD-0402]
C100  0.3pF, GQM1555C2DR30WB01D  [SMD-0402]
C101  10uF, NMC0603X5R106M25TRPF  [SMD-0603]
C102  100nF, NMC0402X7R104K16TRPF  [SMD-0402]
C103  10uF, NMC0603X5R106M25TRPF  [SMD-0603]
C104  100nF, NMC0402X7R104K16TRPF  [SMD-0402]
C105  10nF  [SMD-0402]
L5  33nH, 0603CS-33NXGRW  [SMD-0603]
Q6  CSD25481F4  [CSD25481F4]
R60  3.7k, RT0402BRD073K7L  [SMD-0402]
R61  1k  [SMD-0402]
R62  0  [SMD-0402]
R69  1k  [SMD-0402]
R70  5.62k, ERJ-2RKF5621X  [SMD-0402]
R71  1k  [SMD-0402]
R72  1k  [SMD-0402]
R73  0, DNI  [SMD-0402]
R74  0  [SMD-0402]
U21  PMA3-83MP+  [MiniCircuits PMA3-83MP+]
U27  ADP7142ARDZ  [ADP7142ARDZ]
U28  UCC27517ADBVT  [TI UCC27517ADBVT]

### Ports
AMP_ENb_5V0, GND, RFIN, RFOUT, VIN_9V0

### Nets
8V0: R60.2
8V0_LDO: C103.2 C104.2 Q6.2(S) R70.2 U27.1(VOUT_1) U27.2(VOUT_2) U28.1(VDD)
8V0_SW: C94.1 C95.1 C96.1 L5.2 Q6.3(D)
GND: C94.2 C95.2 C96.2 C99.1 C100.2 C101.1 C102.1 C103.1 C104.1 C105.1 R61.1 R71.1 R72.1 U21.1(NC_1) U21.3(NC_2) U21.4(NC_3) U21.5(NC_4) U21.6(NC_5) U21.7(NC_6) U21.9(NC_7) U21.10(NC_8) U21.11(NC_9) U21.13(EP) U27.4(GND) U27.9(EP) U28.2(GND) U28.4(IN-) ; port GND
AMP_ENb_5V0: R62.2 ; port AMP_ENb_5V0
RFIN: C97.2 ; port RFIN
RFOUT: C98.2 ; port RFOUT
VIN_9V0: C101.2 C102.2 R69.2 U27.7(VIN_1) U27.8(VIN_2) ; port VIN_9V0
NetC97_1: C97.1 C99.2 U21.2(RF-IN)
NetC98_1: C98.1 C100.1 L5.1 U21.8(RF-OUT&VDD)
NetC105_2: C105.2 U27.6(SS)
NetQ6_1: Q6.1(G) R74.1
NetR60_1: R60.1 R61.2 R73.2
NetR62_1: R62.1 U28.3(IN+)
NetR69_1: R69.1 R71.2 U27.5(EN)
NetR70_1: R70.1 R72.2 U27.3(SENSE/ADJ)
NetR73_1: R73.1 U21.12(LADJ)
NetR74_2: R74.2 U28.5(OUT)

### Channels
PMA_01: designators end in _1; ports AMP_ENb_5V0=TX_MAIN_ENb GND=GND RFIN=NetC23_16_1 RFOUT=NetC98_1_2 VIN_9V0=9V0
PMA_02: designators end in _2; ports AMP_ENb_5V0=TX_MAIN_ENb GND=GND RFIN=NetC23_17_1 RFOUT=NetC98_2_2 VIN_9V0=9V0
PMA_03: designators end in _3; ports AMP_ENb_5V0=TX_MAIN_ENb GND=GND RFIN=NetC23_18_1 RFOUT=NetC98_3_2 VIN_9V0=9V0
PMA_04: designators end in _4; ports AMP_ENb_5V0=TX_MAIN_ENb GND=GND RFIN=NetC23_19_1 RFOUT=NetC98_4_2 VIN_9V0=9V0
PMA_05: designators end in _5; ports AMP_ENb_5V0=TX_MAIN_ENb GND=GND RFIN=NetC23_20_1 RFOUT=NetC98_5_2 VIN_9V0=9V0
PMA_06: designators end in _6; ports AMP_ENb_5V0=TX_MAIN_ENb GND=GND RFIN=NetC23_21_1 RFOUT=NetC98_6_2 VIN_9V0=9V0
PMA_07: designators end in _7; ports AMP_ENb_5V0=TX_MAIN_ENb GND=GND RFIN=NetC23_22_1 RFOUT=NetC98_7_2 VIN_9V0=9V0

### Notes on the sheet
- (near C94) We have plenty of bulk capacitance at the LDO output
- Looks like PIN12 is internally biased.
- We have a backup for 1.7V
- (near U27) 1V2
- (in symbol MiniCircuits PMA3-83MP+) Ground the NC pins

### Library data of the parts
C94-C100 C102 C104 C105 = CAP0402: Ceramic Capacitor 0402
C101 C103 = CAP0603: Ceramic Capacitor 0603
L5 = L0603: Inductor 0603
Q6 = CSD25481F4: as Q2 on sheet TX_PA_Stage2; MP: CSD25481F4; Purchase-URL: https://pricing.snapeda.com/search/part/CSD25481F4/?ref=eda; Price: None; SnapEDA_Link: https://www.snapeda.com/parts/CSD25481F4/Texas%20Instruments/view-part/808987/?ref=snap; Check_prices: https://www.snapeda.com/parts/CSD25481F4/Texas%20Instruments/view-part/808987/?ref=eda; Package: PICOSTAR-3 Texas Instruments; Availability: Good; Value: *
R60-R62 R69-R74 = RES0402: Resistor-0402
U21 = MiniCircuits PMA3-83MP+: RF Amplifier SMT Gain Block, 400 - 8000 MHz, 50 Ohm; Manufacturer_Name: Mini-Circuits; Geometry.Height: 0.89mm; Manufacturer_Part_Number: PMA3-83MP+; Mouser Part Number: 139-PMA3-83MP+; Mouser Price/Stock: https://www.mouser.co.uk/ProductDetail/Mini-Circuits/PMA3-83MP%2b?qs=t7xnP681wgVrgODXnnL%252BqQ%3D%3D; Arrow Part Number: *; Arrow Price/Stock: *; Datasheet Link: https://www.mouser.com/datasheet/2/1030/PMA3_83MP_2b-2941862.pdf
U27 = ADP7142ARDZ: 40 V, 200 mA, Low Noise, CMOS LDO Linear Regulator; Manufacturer_Name: Analog Devices; Geometry.Height: 1.75mm; Manufacturer_Part_Number: ADP7142ARDZ; Mouser Part Number: 584-ADP7142ARDZ; Mouser Price/Stock: https://www.mouser.co.uk/ProductDetail/Analog-Devices/ADP7142ARDZ?qs=hpwIUhX6lWzV4WLkPn0q6A%3D%3D; Arrow Part Number: ADP7142ARDZ; Arrow Price/Stock: https://www.arrow.com/en/products/adp7142ardz/analog-devices?region=europe; Datasheet Link: https://www.analog.com/ADP7142/datasheet
U28 = TI UCC27517ADBVT: 4A/4A Single Channel High-speed Low-side Gate Driver with 5V Negative Input Voltage Handling Ability; Manufacturer_Name: Texas Instruments; Geometry.Height: 1.45mm; Manufacturer_Part_Number: UCC27517ADBVT; Mouser Part Number: 595-UCC27517ADBVT; Mouser Price/Stock: https://www.mouser.co.uk/ProductDetail/Texas-Instruments/UCC27517ADBVT?qs=e5T%2FzGlhGOYaAK84OEzaaQ%3D%3D; Arrow Part Number: UCC27517ADBVT; Arrow Price/Stock: https://www.arrow.com/en/products/ucc27517adbvt_1/texas-instruments.html?utm_currency=USD&region=nac; Datasheet Link: http://www.ti.com/general/docs/lit/getliterature.tsp?genericPartNumber=UCC27517A&&fileType=pdf

## Sheet Power_Supply.SchDoc
size B; SheetNumber: 16; SheetTotal: 17
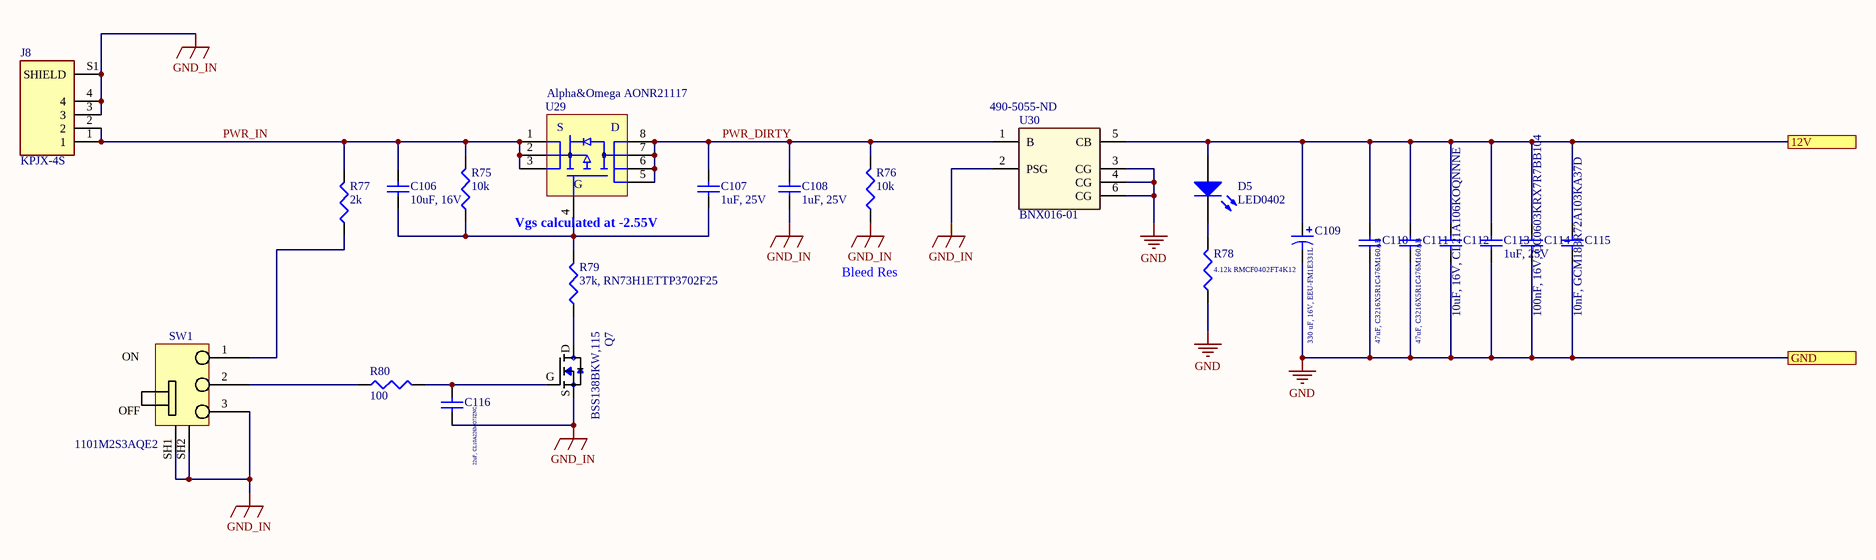
[diagram p18: Power_Supply.SchDoc]

### Parts
C106  10uF, 16V  [SMD-0603]
C107  1uF, 25V  [SMD-0603]
C108  1uF, 25V  [SMD-0603]
C109  330 uF, 16V, EEU-FM1E331L  [CAP-AXIAL-8.0-3.5]
C110  47uF, C3216X5R1C476M160AB  [SMD-1206]
C111  47uF, C3216X5R1C476M160AB  [SMD-1206]
C112  10uF, 16V, CL21A106KOQNNNE  [SMD-0805]
C113  1uF, 25V  [SMD-0603]
C114  100nF, 16V, CC0603KRX7R7BB104  [SMD-0603]
C115  10nF, GCM188R72A103KA37D  [SMD-0603]
C116  22uF, CL10A226MO7JZNC  [SMD-0603]
D5  LED0402  [LED-0402]
J8  KPJX-4S  [KYCON_KPJX-4S]
Q7  BSS138BKW,115  [BSS138BKW,115]
R75  10k  [SMD-0402]
R76  10k  [SMD-0402]
R77  2k  [SMD-0402]
R78  4.12k RMCF0402FT4K12  [SMD-0402]
R79  37k, RN73H1ETTP3702F25  [SMD-0402]
R80  100  [SMD-0402]
SW1  1101M2S3AQE2  [1101M2S3ABE2]
U29  Alpha&Omega AONR21117  [Alpha&Omega_AONR21321]
U30  BNX016-01  Supplier Part Number 1: 490-5055-ND  [FIL_BNX016-01]

### Ports
12V, GND

### Nets
+12: C109.1 C110.2 C111.2 C112.2 C113.2 C114.2 C115.2 D5.2(A) U30.5(CB) ; port 12V
GND: C109.2 C110.1 C111.1 C112.1 C113.1 C114.1 C115.1 R78.1 U30.3(CG) U30.4(CG) U30.6(CG) ; port GND
GND_IN: C108.1 C116.1 J8.3 J8.4 J8.S1(SHIELD) Q7.S R76.1 SW1.3 SW1.SH1 SW1.SH2 U30.2(PSG)
PWR_DIRTY: C107.2 C108.2 R76.2 U29.5 U29.6 U29.7 U29.8 U30.1(B)
PWR_IN: C106.2 J8.1 J8.2 R75.2 R77.2 U29.1 U29.2 U29.3
NetC106_1: C106.1 C107.1 R75.1 R79.2 U29.4
NetC116_2: C116.2 Q7.G R80.2
NetD5_1: D5.1(K) R78.2
NetQ7_D: Q7.D R79.1
NetR77_1: R77.1 SW1.1
NetR80_1: R80.1 SW1.2

### Notes on the sheet
- Vgs calculated at -2.55V
- Bleed Res
- (in symbol 11-1M2S3AQE2) ON; OFF
- (in symbol Alpha&Omega AONR21117) S; D; G

### Library data of the parts
C106 C114-C116 = CAP0603: Ceramic Capacitor 0603
C107 C108 C113 = CAP0603_HV: Ceramic Capacitor 0603, 25V
C109 = CAP_ELECTRO: CAP ALUM 330UF 20% 25V RADIAL EEU-FM1E331
C110 C111 = CAP1206: Ceramic Capacitor 1206 Imperial
C112 = CAP0805: as C30 on sheet Buck_TPSM82913_5V5
D5 = LED0402: LED 0402
J8 = KPJX-4S: 4 _Power_ Position Circular Connector Jack, Female Sockets Solder; MF: Kycon; Value: *; Package: DIP-20 Kycon; Price: None; MP: KPJX-4S; Availability: Unavailable; SnapEDA_Link: https://www.snapeda.com/parts/KPJX-4S/Kycon/view-part/555404/?ref=snap
Q7 = BSS138: as Q1 on sheet Trigger_Input; MP: BSS138; Price: None; Availability: Unavailable; Package: TO-236-3 Micross; SnapEDA_Link: https://www.snapeda.com/parts/BSS138/MICROSS/On%20Semiconductor/view-part/?ref=snap; Value: *
R75-R80 = RES0402: Resistor-0402
SW1 = 11-1M2S3AQE2: SPDT, RIGHT ANGLE, PC THRU-HOLE; pin to pad: SH1>4 SH2>5
U29 = Alpha&Omega AONR21117: P-Channel 20-V (D-S) MOSFET
U30 = BNX016-01: Filter: anti-interference; wideband; Mounting: THT; 15A; -40Ã·125Â°; MF: Murata Electronics; MP: BNX016-01; Digi-Key_Purchase_URL: https://www.digikey.com/product-detail/en/murata-electronics/BNX016-01/490-5055-ND/1825576?utm_source=snapeda&utm_medium=aggregator&utm_campaign=symbol; Package: Block-4 Murata; SnapEDA_Link: https://www.snapeda.com/parts/BNX016-01/Murata%20Electronics%20North%20America/view-part/?ref=snap; Digi-Key_Part_Number: 490-5055-ND; Value: *; Supplier 1: Digi-Key

## Sheet RX_LNA_Preamp.SchDoc
size A4; SheetNumber: 11; SheetTotal: 13
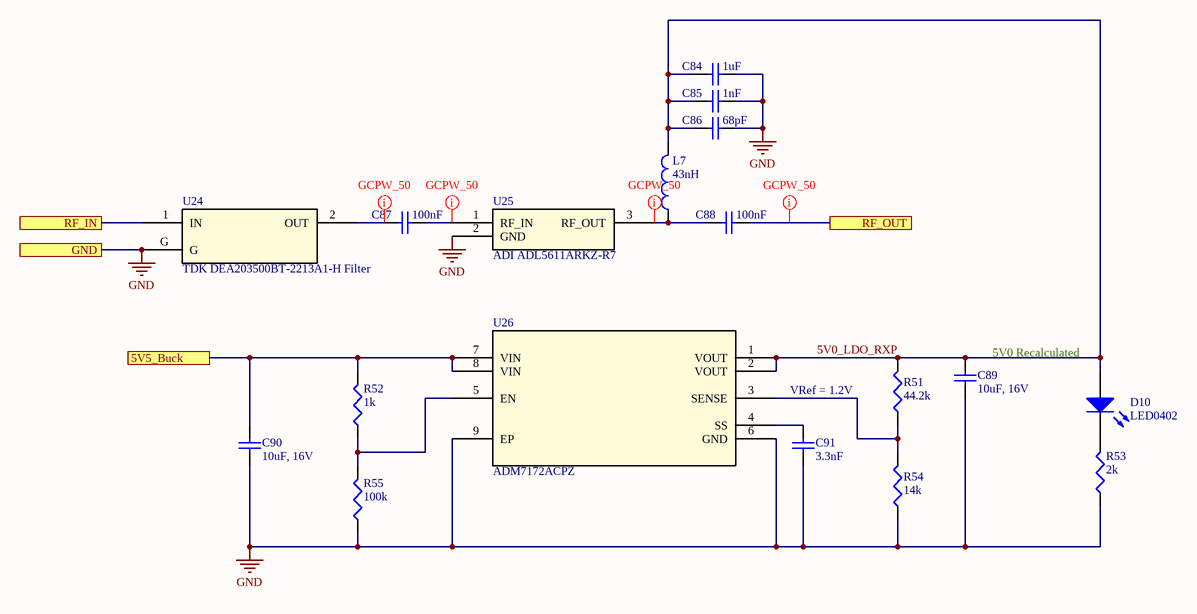
[diagram p19: RX_LNA_Preamp.SchDoc]

### Parts
C84  1uF  [SMD-0402]
C85  1nF  [SMD-0402]
C86  68pF  [SMD-0402]
C87  100nF  [SMD-0402]
C88  100nF  [SMD-0402]
C89  10uF, 16V  [SMD-0603]
C90  10uF, 16V  [SMD-0603]
C91  3.3nF  [Johanson-0201]
D10  LED0402  [LED-0402]
L7  43nH  [SMD-0603]
R51  44.2k  [SMD-0402]
R52  1k  [SMD-0402]
R53  2k  [SMD-0402]
R54  14k  [SMD-0402]
R55  100k  [SMD-0402]
U24  TDK DEA203500BT-2213A1-H Filter  [TDK DEA203500BT-2213A1-H Bandpass Filter]
U25  ADI ADL5611ARKZ-R7  [Analog Devices ADL5545ARKZ]
U26  ADM7172ACPZ  [ADM7172_VIA_NOSILK]

### Ports
5V5_Buck, GND, RF_IN, RF_OUT

### Nets
GND: C84.1 C85.1 C86.1 C89.1 C90.1 C91.1 R53.1 R54.1 R55.1 U24.G U25.2(GND) U26.6(GND) U26.9(EP) ; port GND
5V0_LDO_RXP: C84.2 C85.2 C86.2 C89.2 D10.1(A) L7.2 R51.2 U26.1(VOUT) U26.2(VOUT)
NetC87_1: C87.1 U25.1(RF_IN)
NetC87_2: C87.2 U24.2(OUT)
NetC88_1: C88.1 ; port RF_OUT
NetC88_2: C88.2 L7.1 U25.3(RF_OUT)
NetC90_2: C90.2 R52.2 U26.7(VIN) U26.8(VIN) ; port 5V5_Buck
NetC91_2: C91.2 U26.4(SS)
NetD10_2: D10.2(K) R53.2
NetR51_1: R51.1 R54.2 U26.3(SENSE)
NetR52_1: R52.1 R55.2 U26.5(EN)
NetU24_1: U24.1(IN) ; port RF_IN

### Layout directives
net class GCPW_50: NetC87_1, NetC87_2, NetC88_1, NetC88_2

### Notes on the sheet
- 5V0 Recalculated
- VRef = 1.2V

### Library data of the parts
C84-C88 = CAP0402: Ceramic Capacitor 0402
C89 C90 = CAP0603: Ceramic Capacitor 0603
C91 = CAP0201: Capacitor 0201 Imperial
D10 = LED0402: LED 0402
L7 = L0603: Inductor 0603
R51-R55 = RES0402: Resistor-0402
U24 = TDK DEA203500BT-2213A1-H Filter: 3.5 GHz Center Freq BPF; Mfr_Name: TDK; RefDes: RefDes; Type: Type
U25 = ADI ADL5611ARKZ-R7: IC AMP W-CDMA 30MHZ-6GHZ SOT89-3; Mfr_Name: Analog Devices Inc; RefDes: RefDes; Type: Type
U26 = ADM7172ACPZ: as U18 on sheet TX_PA_Stage2; Value: Value; Type: Type; RefDes: RefDes

## Nets that join several sheets
5V5_A: TX_PA_00 (C9_1.2 R2_1.2 U4_1.7 U4_1.8), TX_PA_01 (C9_2.2 R2_2.2 U4_2.7 U4_2.8), TX_PA_02 (C9_3.2 R2_3.2 U4_3.7 U4_3.8), TX_PA_03 (C9_4.2 R2_4.2 U4_4.7 U4_4.8), TX_PA_04 (C9_5.2 R2_5.2 U4_5.7 U4_5.8), TX_PA_05 (C9_6.2 R2_6.2 U4_6.7 U4_6.8), TX_PA_06 (C9_7.2 R2_7.2 U4_7.7 U4_7.8), TX_PA_07 (C9_8.2 R2_8.2 U4_8.7 U4_8.8), U_Power/Buck_TPSM82913_5V5_A (6 pins), PA_A_00 (C72_1.2 R29_1.2 U18_1.7 U18_1.8), PA_A_01 (C72_2.2 R29_2.2 U18_2.7 U18_2.8), PA_A_02 (C72_3.2 R29_3.2 U18_3.7 U18_3.8), PA_A_03 (C72_4.2 R29_4.2 U18_4.7 U18_4.8), PA_A_04 (C72_5.2 R29_5.2 U18_5.7 U18_5.8), PA_A_05 (C72_6.2 R29_6.2 U18_6.7 U18_6.8), PA_A_06 (C72_7.2 R29_7.2 U18_7.7 U18_7.8), PA_A_07 (C72_8.2 R29_8.2 U18_8.7 U18_8.8), U_Switch_SPDT (C77_1.2 R35_1.2 U20_1.7 U20_1.8), TX_Final_Amp_01 (C25_16.2 R7_16.2 U8_16.7 U8_16.8), TX_Final_Amp_02 (C25_17.2 R7_17.2 U8_17.7 U8_17.8), TX_Final_Amp_03 (C25_18.2 R7_18.2 U8_18.7 U8_18.8), TX_Final_Amp_04 (C25_19.2 R7_19.2 U8_19.7 U8_19.8), TX_Final_Amp_05 (C25_20.2 R7_20.2 U8_20.7 U8_20.8), TX_Final_Amp_06 (C25_21.2 R7_21.2 U8_21.7 U8_21.8), TX_Final_Amp_07 (C25_22.2 R7_22.2 U8_22.7 U8_22.8)
5V5_B: RX_LNA_A_01 (C25_1.2 R7_1.2 U8_1.7 U8_1.8), RX_LNA_A_02 (C25_2.2 R7_2.2 U8_2.7 U8_2.8), RX_LNA_A_03 (C25_3.2 R7_3.2 U8_3.7 U8_3.8), RX_LNA_A_04 (C25_4.2 R7_4.2 U8_4.7 U8_4.8), RX_LNA_A_05 (C25_5.2 R7_5.2 U8_5.7 U8_5.8), RX_LNA_A_06 (C25_6.2 R7_6.2 U8_6.7 U8_6.8), RX_LNA_A_07 (C25_7.2 R7_7.2 U8_7.7 U8_7.8), U_Power/Buck_TPSM82913_5V5_B (6 pins), Status_LEDs (8 pins), VGA_A_01 (C92_1.2 R65_1.2 U6_1.7 U6_1.8), VGA_A_02 (C92_2.2 R65_2.2 U6_2.7 U6_2.8), VGA_A_03 (C92_3.2 R65_3.2 U6_3.7 U6_3.8), VGA_A_04 (C92_4.2 R65_4.2 U6_4.7 U6_4.8), VGA_A_05 (C92_5.2 R65_5.2 U6_5.7 U6_5.8), VGA_A_06 (C92_6.2 R65_6.2 U6_6.7 U6_6.8), VGA_A_07 (C92_7.2 R65_7.2 U6_7.7 U6_7.8)
5V5_C: RX_LNA_A_00 (C25_8.2 R7_8.2 U8_8.7 U8_8.8), U_Power/Buck_TPSM82913_5V5_C (6 pins), U_Switch_SPDT (C77_2.2 R35_2.2 U20_2.7 U20_2.8), RX_LNA_B_01 (C25_9.2 R7_9.2 U8_9.7 U8_9.8), RX_LNA_B_02 (C25_10.2 R7_10.2 U8_10.7 U8_10.8), RX_LNA_B_03 (C25_11.2 R7_11.2 U8_11.7 U8_11.8), RX_LNA_B_04 (C25_12.2 R7_12.2 U8_12.7 U8_12.8), RX_LNA_B_05 (C25_13.2 R7_13.2 U8_13.7 U8_13.8), RX_LNA_B_06 (C25_14.2 R7_14.2 U8_14.7 U8_14.8), RX_LNA_B_07 (C25_15.2 R7_15.2 U8_15.7 U8_15.8), VGA_B_01 (C92_8.2 R65_8.2 U6_8.7 U6_8.8), VGA_B_02 (C92_9.2 R65_9.2 U6_9.7 U6_9.8), VGA_B_03 (C92_10.2 R65_10.2 U6_10.7 U6_10.8), VGA_B_04 (C92_11.2 R65_11.2 U6_11.7 U6_11.8), VGA_B_05 (C92_12.2 R65_12.2 U6_12.7 U6_12.8), VGA_B_06 (C92_13.2 R65_13.2 U6_13.7 U6_13.8), VGA_B_07 (C92_14.2 R65_14.2 U6_14.7 U6_14.8)
9V0: Buck_TPSM843321_9V0 (C58.2 C59.2 R82.2 U31.4), PMA_01 (5 pins), PMA_02 (5 pins), PMA_03 (5 pins), PMA_04 (5 pins), PMA_05 (5 pins), PMA_06 (5 pins), PMA_07 (5 pins)
+12: Power (14 pins), U_Power/Buck_TPSM82913_5V5_A (5 pins), U_Power/Buck_TPSM82913_5V5_B (5 pins), U_Power/Buck_TPSM82913_5V5_C (5 pins), Buck_TPSM843321_9V0 (5 pins), Power_Supply (9 pins)
GND: Main (49 pins), Connector_DAC_Side (239 pins), Connector_ADC_Side (240 pins), RX_LNA_A_01 (13 pins), RX_LNA_A_02 (13 pins), RX_LNA_A_03 (13 pins), RX_LNA_A_04 (13 pins), RX_LNA_A_05 (13 pins), RX_LNA_A_06 (13 pins), RX_LNA_A_07 (13 pins), RX_LNA_A_00 (13 pins), TX_PA_00 (17 pins), TX_PA_01 (17 pins), TX_PA_02 (17 pins), TX_PA_03 (17 pins), TX_PA_04 (17 pins), TX_PA_05 (17 pins), TX_PA_06 (17 pins), TX_PA_07 (17 pins), Power (14 pins), U_Power/Buck_TPSM82913_5V5_A (30 pins), U_Power/Buck_TPSM82913_5V5_B (30 pins), U_Power/Buck_TPSM82913_5V5_C (30 pins), Buck_TPSM843321_9V0 (11 pins), PA_A_00 (15 pins), PA_A_01 (15 pins), PA_A_02 (15 pins), PA_A_03 (15 pins), PA_A_04 (15 pins), PA_A_05 (15 pins), PA_A_06 (15 pins), PA_A_07 (15 pins), U_Switch_SPDT (23 pins), U_Switch_SPDT (23 pins), Status_LEDs (22 pins), Trigger_Input (J7.G Q1.S), SE_Diff_RX_00 (U15_1.2 U15_1.5), SE_Diff_RX_01 (U15_2.2 U15_2.5), SE_Diff_RX_02 (U15_3.2 U15_3.5), SE_Diff_RX_03 (U15_4.2 U15_4.5), SE_Diff_RX_04 (U15_5.2 U15_5.5), SE_Diff_RX_05 (U15_6.2 U15_6.5), SE_Diff_RX_06 (U15_7.2 U15_7.5), SE_Diff_RX_07 (U15_8.2 U15_8.5), RX_LNA_B_01 (13 pins), RX_LNA_B_02 (13 pins), RX_LNA_B_03 (13 pins), RX_LNA_B_04 (13 pins), RX_LNA_B_05 (13 pins), RX_LNA_B_06 (13 pins), RX_LNA_B_07 (13 pins), VGA_A_01 (29 pins), VGA_A_02 (29 pins), VGA_A_03 (29 pins), VGA_A_04 (29 pins), VGA_A_05 (29 pins), VGA_A_06 (29 pins), VGA_A_07 (29 pins), VGA_B_01 (29 pins), VGA_B_02 (29 pins), VGA_B_03 (29 pins), VGA_B_04 (29 pins), VGA_B_05 (29 pins), VGA_B_06 (29 pins), VGA_B_07 (29 pins), TX_Final_Amp_01 (13 pins), TX_Final_Amp_02 (13 pins), TX_Final_Amp_03 (13 pins), TX_Final_Amp_04 (13 pins), TX_Final_Amp_05 (13 pins), TX_Final_Amp_06 (13 pins), TX_Final_Amp_07 (13 pins), PMA_01 (27 pins), PMA_02 (27 pins), PMA_03 (27 pins), PMA_04 (27 pins), PMA_05 (27 pins), PMA_06 (27 pins), PMA_07 (27 pins), Power_Supply (11 pins)
1V8_LDO: Status_LEDs (7 pins), Trigger_Input (R22.2)
ADC_00_N: Connector_ADC_Side (U1.F9), SE_Diff_RX_00 (C57_1.1)
ADC_00_P: Connector_ADC_Side (U1.G9), SE_Diff_RX_00 (C55_1.1)
ADC_01_N: Connector_ADC_Side (U1.B10), SE_Diff_RX_01 (C57_2.1)
ADC_01_P: Connector_ADC_Side (U1.C10), SE_Diff_RX_01 (C55_2.1)
ADC_02_N: Connector_ADC_Side (U1.F12), SE_Diff_RX_02 (C57_3.1)
ADC_02_P: Connector_ADC_Side (U1.G12), SE_Diff_RX_02 (C55_3.1)
ADC_03_N: Connector_ADC_Side (U1.B13), SE_Diff_RX_03 (C57_4.1)
ADC_03_P: Connector_ADC_Side (U1.C13), SE_Diff_RX_03 (C55_4.1)
ADC_04_N: Connector_ADC_Side (U1.F15), SE_Diff_RX_04 (C57_5.1)
ADC_04_P: Connector_ADC_Side (U1.G15), SE_Diff_RX_04 (C55_5.1)
ADC_05_N: Connector_ADC_Side (U1.B16), SE_Diff_RX_05 (C57_6.1)
ADC_05_P: Connector_ADC_Side (U1.C16), SE_Diff_RX_05 (C55_6.1)
ADC_06_N: Connector_ADC_Side (U1.F18), SE_Diff_RX_06 (C57_7.1)
ADC_06_P: Connector_ADC_Side (U1.G18), SE_Diff_RX_06 (C55_7.1)
ADC_07_N: Connector_ADC_Side (U1.B19), SE_Diff_RX_07 (C57_8.1)
ADC_07_P: Connector_ADC_Side (U1.C19), SE_Diff_RX_07 (C55_8.1)
ATT_CTRL.D0: Connector_ADC_Side (U1.F1), VGA_A_01 (U14_1.23), VGA_A_02 (U14_2.23), VGA_A_03 (U14_3.23), VGA_A_04 (U14_4.23), VGA_A_05 (U14_5.23), VGA_A_06 (U14_6.23), VGA_A_07 (U14_7.23), VGA_B_01 (U14_8.23), VGA_B_02 (U14_9.23), VGA_B_03 (U14_10.23), VGA_B_04 (U14_11.23), VGA_B_05 (U14_12.23), VGA_B_06 (U14_13.23), VGA_B_07 (U14_14.23)
ATT_CTRL.D1: Connector_ADC_Side (U1.E4), VGA_A_01 (U14_1.22), VGA_A_02 (U14_2.22), VGA_A_03 (U14_3.22), VGA_A_04 (U14_4.22), VGA_A_05 (U14_5.22), VGA_A_06 (U14_6.22), VGA_A_07 (U14_7.22), VGA_B_01 (U14_8.22), VGA_B_02 (U14_9.22), VGA_B_03 (U14_10.22), VGA_B_04 (U14_11.22), VGA_B_05 (U14_12.22), VGA_B_06 (U14_13.22), VGA_B_07 (U14_14.22)
ATT_CTRL.D2: Connector_ADC_Side (U1.E2), VGA_A_01 (U14_1.21), VGA_A_02 (U14_2.21), VGA_A_03 (U14_3.21), VGA_A_04 (U14_4.21), VGA_A_05 (U14_5.21), VGA_A_06 (U14_6.21), VGA_A_07 (U14_7.21), VGA_B_01 (U14_8.21), VGA_B_02 (U14_9.21), VGA_B_03 (U14_10.21), VGA_B_04 (U14_11.21), VGA_B_05 (U14_12.21), VGA_B_06 (U14_13.21), VGA_B_07 (U14_14.21)
ATT_CTRL.D3: Connector_ADC_Side (U1.D5), VGA_A_01 (U14_1.20), VGA_A_02 (U14_2.20), VGA_A_03 (U14_3.20), VGA_A_04 (U14_4.20), VGA_A_05 (U14_5.20), VGA_A_06 (U14_6.20), VGA_A_07 (U14_7.20), VGA_B_01 (U14_8.20), VGA_B_02 (U14_9.20), VGA_B_03 (U14_10.20), VGA_B_04 (U14_11.20), VGA_B_05 (U14_12.20), VGA_B_06 (U14_13.20), VGA_B_07 (U14_14.20)
ATT_CTRL.D4: Connector_ADC_Side (U1.D3), VGA_A_01 (U14_1.19), VGA_A_02 (U14_2.19), VGA_A_03 (U14_3.19), VGA_A_04 (U14_4.19), VGA_A_05 (U14_5.19), VGA_A_06 (U14_6.19), VGA_A_07 (U14_7.19), VGA_B_01 (U14_8.19), VGA_B_02 (U14_9.19), VGA_B_03 (U14_10.19), VGA_B_04 (U14_11.19), VGA_B_05 (U14_12.19), VGA_B_06 (U14_13.19), VGA_B_07 (U14_14.19)
ATT_CTRL.D5: Connector_ADC_Side (U1.D1), VGA_A_01 (U14_1.18), VGA_A_02 (U14_2.18), VGA_A_03 (U14_3.18), VGA_A_04 (U14_4.18), VGA_A_05 (U14_5.18), VGA_A_06 (U14_6.18), VGA_A_07 (U14_7.18), VGA_B_01 (U14_8.18), VGA_B_02 (U14_9.18), VGA_B_03 (U14_10.18), VGA_B_04 (U14_11.18), VGA_B_05 (U14_12.18), VGA_B_06 (U14_13.18), VGA_B_07 (U14_14.18)
CTRL1: U_Switch_SPDT (R33_1.1), U_Switch_SPDT (R33_2.1), Status_LEDs (R50.1 U23.4)
CTRL2: Connector_ADC_Side (U1.H5), U_Switch_SPDT (R34_1.1), U_Switch_SPDT (R34_2.1), Status_LEDs (R49.1 U23.2)
DAC_00_N: Connector_DAC_Side (U2.B10), TX_PA_00 (C12_1.1)
DAC_00_P: Connector_DAC_Side (U2.C10), TX_PA_00 (C11_1.1)
DAC_01_N: Connector_DAC_Side (U2.F11), TX_PA_01 (C12_2.1)
DAC_01_P: Connector_DAC_Side (U2.G11), TX_PA_01 (C11_2.1)
DAC_02_N: Connector_DAC_Side (U2.B13), TX_PA_02 (C12_3.1)
DAC_02_P: Connector_DAC_Side (U2.C13), TX_PA_02 (C11_3.1)
DAC_03_N: Connector_DAC_Side (U2.F14), TX_PA_03 (C12_4.1)
DAC_03_P: Connector_DAC_Side (U2.G14), TX_PA_03 (C11_4.1)
DAC_04_N: Connector_DAC_Side (U2.B16), TX_PA_04 (C12_5.1)
DAC_04_P: Connector_DAC_Side (U2.C16), TX_PA_04 (C11_5.1)
DAC_05_N: Connector_DAC_Side (U2.F17), TX_PA_05 (C12_6.1)
DAC_05_P: Connector_DAC_Side (U2.G17), TX_PA_05 (C11_6.1)
DAC_06_N: Connector_DAC_Side (U2.B19), TX_PA_06 (C12_7.1)
DAC_06_P: Connector_DAC_Side (U2.C19), TX_PA_06 (C11_7.1)
DAC_07_N: Connector_DAC_Side (U2.F20), TX_PA_07 (C12_8.1)
DAC_07_P: Connector_DAC_Side (U2.G20), TX_PA_07 (C11_8.1)
NetC5_1_2: TX_PA_00 (C5_1.2), PA_A_00 (C66_1.1)
NetC5_2_2: TX_PA_01 (C5_2.2), PA_A_01 (C66_2.1)
NetC5_3_2: TX_PA_02 (C5_3.2), PA_A_02 (C66_3.1)
NetC5_4_2: TX_PA_03 (C5_4.2), PA_A_03 (C66_4.1)
NetC5_5_2: TX_PA_04 (C5_5.2), PA_A_04 (C66_5.1)
NetC5_6_2: TX_PA_05 (C5_6.2), PA_A_05 (C66_6.1)
NetC5_7_2: TX_PA_06 (C5_7.2), PA_A_06 (C66_7.1)
NetC5_8_2: TX_PA_07 (C5_8.2), PA_A_07 (C66_8.1)
NetC21_1_2: Main (J_RX_1.S), RX_LNA_A_01 (C21_1.2)
NetC21_2_2: Main (J_RX_2.S), RX_LNA_A_02 (C21_2.2)
NetC21_3_2: Main (J_RX_3.S), RX_LNA_A_03 (C21_3.2)
NetC21_4_2: Main (J_RX_4.S), RX_LNA_A_04 (C21_4.2)
NetC21_5_2: Main (J_RX_5.S), RX_LNA_A_05 (C21_5.2)
NetC21_6_2: Main (J_RX_6.S), RX_LNA_A_06 (C21_6.2)
NetC21_7_2: Main (J_RX_7.S), RX_LNA_A_07 (C21_7.2)
NetC21_8_2: RX_LNA_A_00 (C21_8.2), U_Switch_SPDT (C74_2.1)
NetC21_9_2: RX_LNA_B_01 (C21_9.2), VGA_A_01 (C44_1.1)
NetC21_10_2: RX_LNA_B_02 (C21_10.2), VGA_A_02 (C44_2.1)
NetC21_11_2: RX_LNA_B_03 (C21_11.2), VGA_A_03 (C44_3.1)
NetC21_12_2: RX_LNA_B_04 (C21_12.2), VGA_A_04 (C44_4.1)
NetC21_13_2: RX_LNA_B_05 (C21_13.2), VGA_A_05 (C44_5.1)
NetC21_14_2: RX_LNA_B_06 (C21_14.2), VGA_A_06 (C44_6.1)
NetC21_15_2: RX_LNA_B_07 (C21_15.2), VGA_A_07 (C44_7.1)
NetC21_16_2: PA_A_01 (C68_2.2), TX_Final_Amp_01 (C21_16.2)
NetC21_17_2: PA_A_02 (C68_3.2), TX_Final_Amp_02 (C21_17.2)
NetC21_18_2: PA_A_03 (C68_4.2), TX_Final_Amp_03 (C21_18.2)
NetC21_19_2: PA_A_04 (C68_5.2), TX_Final_Amp_04 (C21_19.2)
NetC21_20_2: PA_A_05 (C68_6.2), TX_Final_Amp_05 (C21_20.2)
NetC21_21_2: PA_A_06 (C68_7.2), TX_Final_Amp_06 (C21_21.2)
NetC21_22_2: PA_A_07 (C68_8.2), TX_Final_Amp_07 (C21_22.2)
NetC23_1_1: RX_LNA_A_01 (C23_1.1), VGA_A_01 (C43_1.2)
NetC23_2_1: RX_LNA_A_02 (C23_2.1), VGA_A_02 (C43_2.2)
NetC23_3_1: RX_LNA_A_03 (C23_3.1), VGA_A_03 (C43_3.2)
NetC23_4_1: RX_LNA_A_04 (C23_4.1), VGA_A_04 (C43_4.2)
NetC23_5_1: RX_LNA_A_05 (C23_5.1), VGA_A_05 (C43_5.2)
NetC23_6_1: RX_LNA_A_06 (C23_6.1), VGA_A_06 (C43_6.2)
NetC23_7_1: RX_LNA_A_07 (C23_7.1), VGA_A_07 (C43_7.2)
NetC23_8_1: RX_LNA_A_00 (C23_8.1), SE_Diff_RX_00 (C56_1.2)
NetC23_9_1: RX_LNA_B_01 (C23_9.1), VGA_B_01 (C43_8.2)
NetC23_10_1: RX_LNA_B_02 (C23_10.1), VGA_B_02 (C43_9.2)
NetC23_11_1: RX_LNA_B_03 (C23_11.1), VGA_B_03 (C43_10.2)
NetC23_12_1: RX_LNA_B_04 (C23_12.1), VGA_B_04 (C43_11.2)
NetC23_13_1: RX_LNA_B_05 (C23_13.1), VGA_B_05 (C43_12.2)
NetC23_14_1: RX_LNA_B_06 (C23_14.1), VGA_B_06 (C43_13.2)
NetC23_15_1: RX_LNA_B_07 (C23_15.1), VGA_B_07 (C43_14.2)
NetC23_16_1: TX_Final_Amp_01 (C23_16.1), PMA_01 (C97_1.2)
NetC23_17_1: TX_Final_Amp_02 (C23_17.1), PMA_02 (C97_2.2)
NetC23_18_1: TX_Final_Amp_03 (C23_18.1), PMA_03 (C97_3.2)
NetC23_19_1: TX_Final_Amp_04 (C23_19.1), PMA_04 (C97_4.2)
NetC23_20_1: TX_Final_Amp_05 (C23_20.1), PMA_05 (C97_5.2)
NetC23_21_1: TX_Final_Amp_06 (C23_21.1), PMA_06 (C97_6.2)
NetC23_22_1: TX_Final_Amp_07 (C23_22.1), PMA_07 (C97_7.2)
NetC44_8_1: SE_Diff_RX_01 (C56_2.2), VGA_B_01 (C44_8.1)
NetC44_9_1: SE_Diff_RX_02 (C56_3.2), VGA_B_02 (C44_9.1)
NetC44_10_1: SE_Diff_RX_03 (C56_4.2), VGA_B_03 (C44_10.1)
NetC44_11_1: SE_Diff_RX_04 (C56_5.2), VGA_B_04 (C44_11.1)
NetC44_12_1: SE_Diff_RX_05 (C56_6.2), VGA_B_05 (C44_12.1)
NetC44_13_1: SE_Diff_RX_06 (C56_7.2), VGA_B_06 (C44_13.1)
NetC44_14_1: SE_Diff_RX_07 (C56_8.2), VGA_B_07 (C44_14.1)
NetC68_1_2: PA_A_00 (C68_1.2), U_Switch_SPDT (C74_1.1)
NetC75_1_2: Main (J_TX_0.S), U_Switch_SPDT (C75_1.2)
NetC75_2_2: Main (J_RX_0.S), U_Switch_SPDT (C75_2.2)
NetC76_1_2: Main (J_gNB_RX.S), U_Switch_SPDT (C76_1.2)
NetC76_2_2: Main (J_gNB_TX.S), U_Switch_SPDT (C76_2.2)
NetC98_1_2: Main (J_TX_1.S), PMA_01 (C98_1.2)
NetC98_2_2: Main (J_TX_2.S), PMA_02 (C98_2.2)
NetC98_3_2: Main (J_TX_3.S), PMA_03 (C98_3.2)
NetC98_4_2: Main (J_TX_4.S), PMA_04 (C98_4.2)
NetC98_5_2: Main (J_TX_5.S), PMA_05 (C98_5.2)
NetC98_6_2: Main (J_TX_6.S), PMA_06 (C98_6.2)
NetC98_7_2: Main (J_TX_7.S), PMA_07 (C98_7.2)
RX_MAIN_ENb: RX_LNA_A_01 (R27_1.2), RX_LNA_A_02 (R27_2.2), RX_LNA_A_03 (R27_3.2), RX_LNA_A_04 (R27_4.2), RX_LNA_A_05 (R27_5.2), RX_LNA_A_06 (R27_6.2), RX_LNA_A_07 (R27_7.2), Status_LEDs (U13.14), RX_LNA_B_01 (R27_9.2), RX_LNA_B_02 (R27_10.2), RX_LNA_B_03 (R27_11.2), RX_LNA_B_04 (R27_12.2), RX_LNA_B_05 (R27_13.2), RX_LNA_B_06 (R27_14.2), RX_LNA_B_07 (R27_15.2), VGA_A_01 (R63_1.2), VGA_A_02 (R63_2.2), VGA_A_03 (R63_3.2), VGA_A_04 (R63_4.2), VGA_A_05 (R63_5.2), VGA_A_06 (R63_6.2), VGA_A_07 (R63_7.2), VGA_B_01 (R63_8.2), VGA_B_02 (R63_9.2), VGA_B_03 (R63_10.2), VGA_B_04 (R63_11.2), VGA_B_05 (R63_12.2), VGA_B_06 (R63_13.2), VGA_B_07 (R63_14.2)
RX_MAIN_ENb_1V8: Connector_ADC_Side (U1.B5), Status_LEDs (U13.10)
RX_REF_ENb: RX_LNA_A_00 (R27_8.2), Status_LEDs (U13.15)
RX_REF_ENb_1V8: Connector_ADC_Side (U1.B3), Status_LEDs (U13.9)
TRIG_IN_1V8: Connector_ADC_Side (U1.H3), Trigger_Input (R23.1)
TX_MAIN_ENb: TX_PA_01 (R26_2.2), TX_PA_02 (R26_3.2), TX_PA_03 (R26_4.2), TX_PA_04 (R26_5.2), TX_PA_05 (R26_6.2), TX_PA_06 (R26_7.2), TX_PA_07 (R26_8.2), PA_A_01 (R25_2.2), PA_A_02 (R25_3.2), PA_A_03 (R25_4.2), PA_A_04 (R25_5.2), PA_A_05 (R25_6.2), PA_A_06 (R25_7.2), PA_A_07 (R25_8.2), Status_LEDs (U13.16), TX_Final_Amp_01 (R27_16.2), TX_Final_Amp_02 (R27_17.2), TX_Final_Amp_03 (R27_18.2), TX_Final_Amp_04 (R27_19.2), TX_Final_Amp_05 (R27_20.2), TX_Final_Amp_06 (R27_21.2), TX_Final_Amp_07 (R27_22.2), PMA_01 (R62_1.2), PMA_02 (R62_2.2), PMA_03 (R62_3.2), PMA_04 (R62_4.2), PMA_05 (R62_5.2), PMA_06 (R62_6.2), PMA_07 (R62_7.2)
TX_MAIN_ENb_1V8: Connector_ADC_Side (U1.B1), Status_LEDs (U13.8)
TX_REF_ENb: TX_PA_00 (R26_1.2), PA_A_00 (R25_1.2), Status_LEDs (U13.17)
TX_REF_ENb_1V8: Connector_ADC_Side (U1.A4), Status_LEDs (U13.7)